# Altium project PCIe_Camera_Interface.PrjPcb
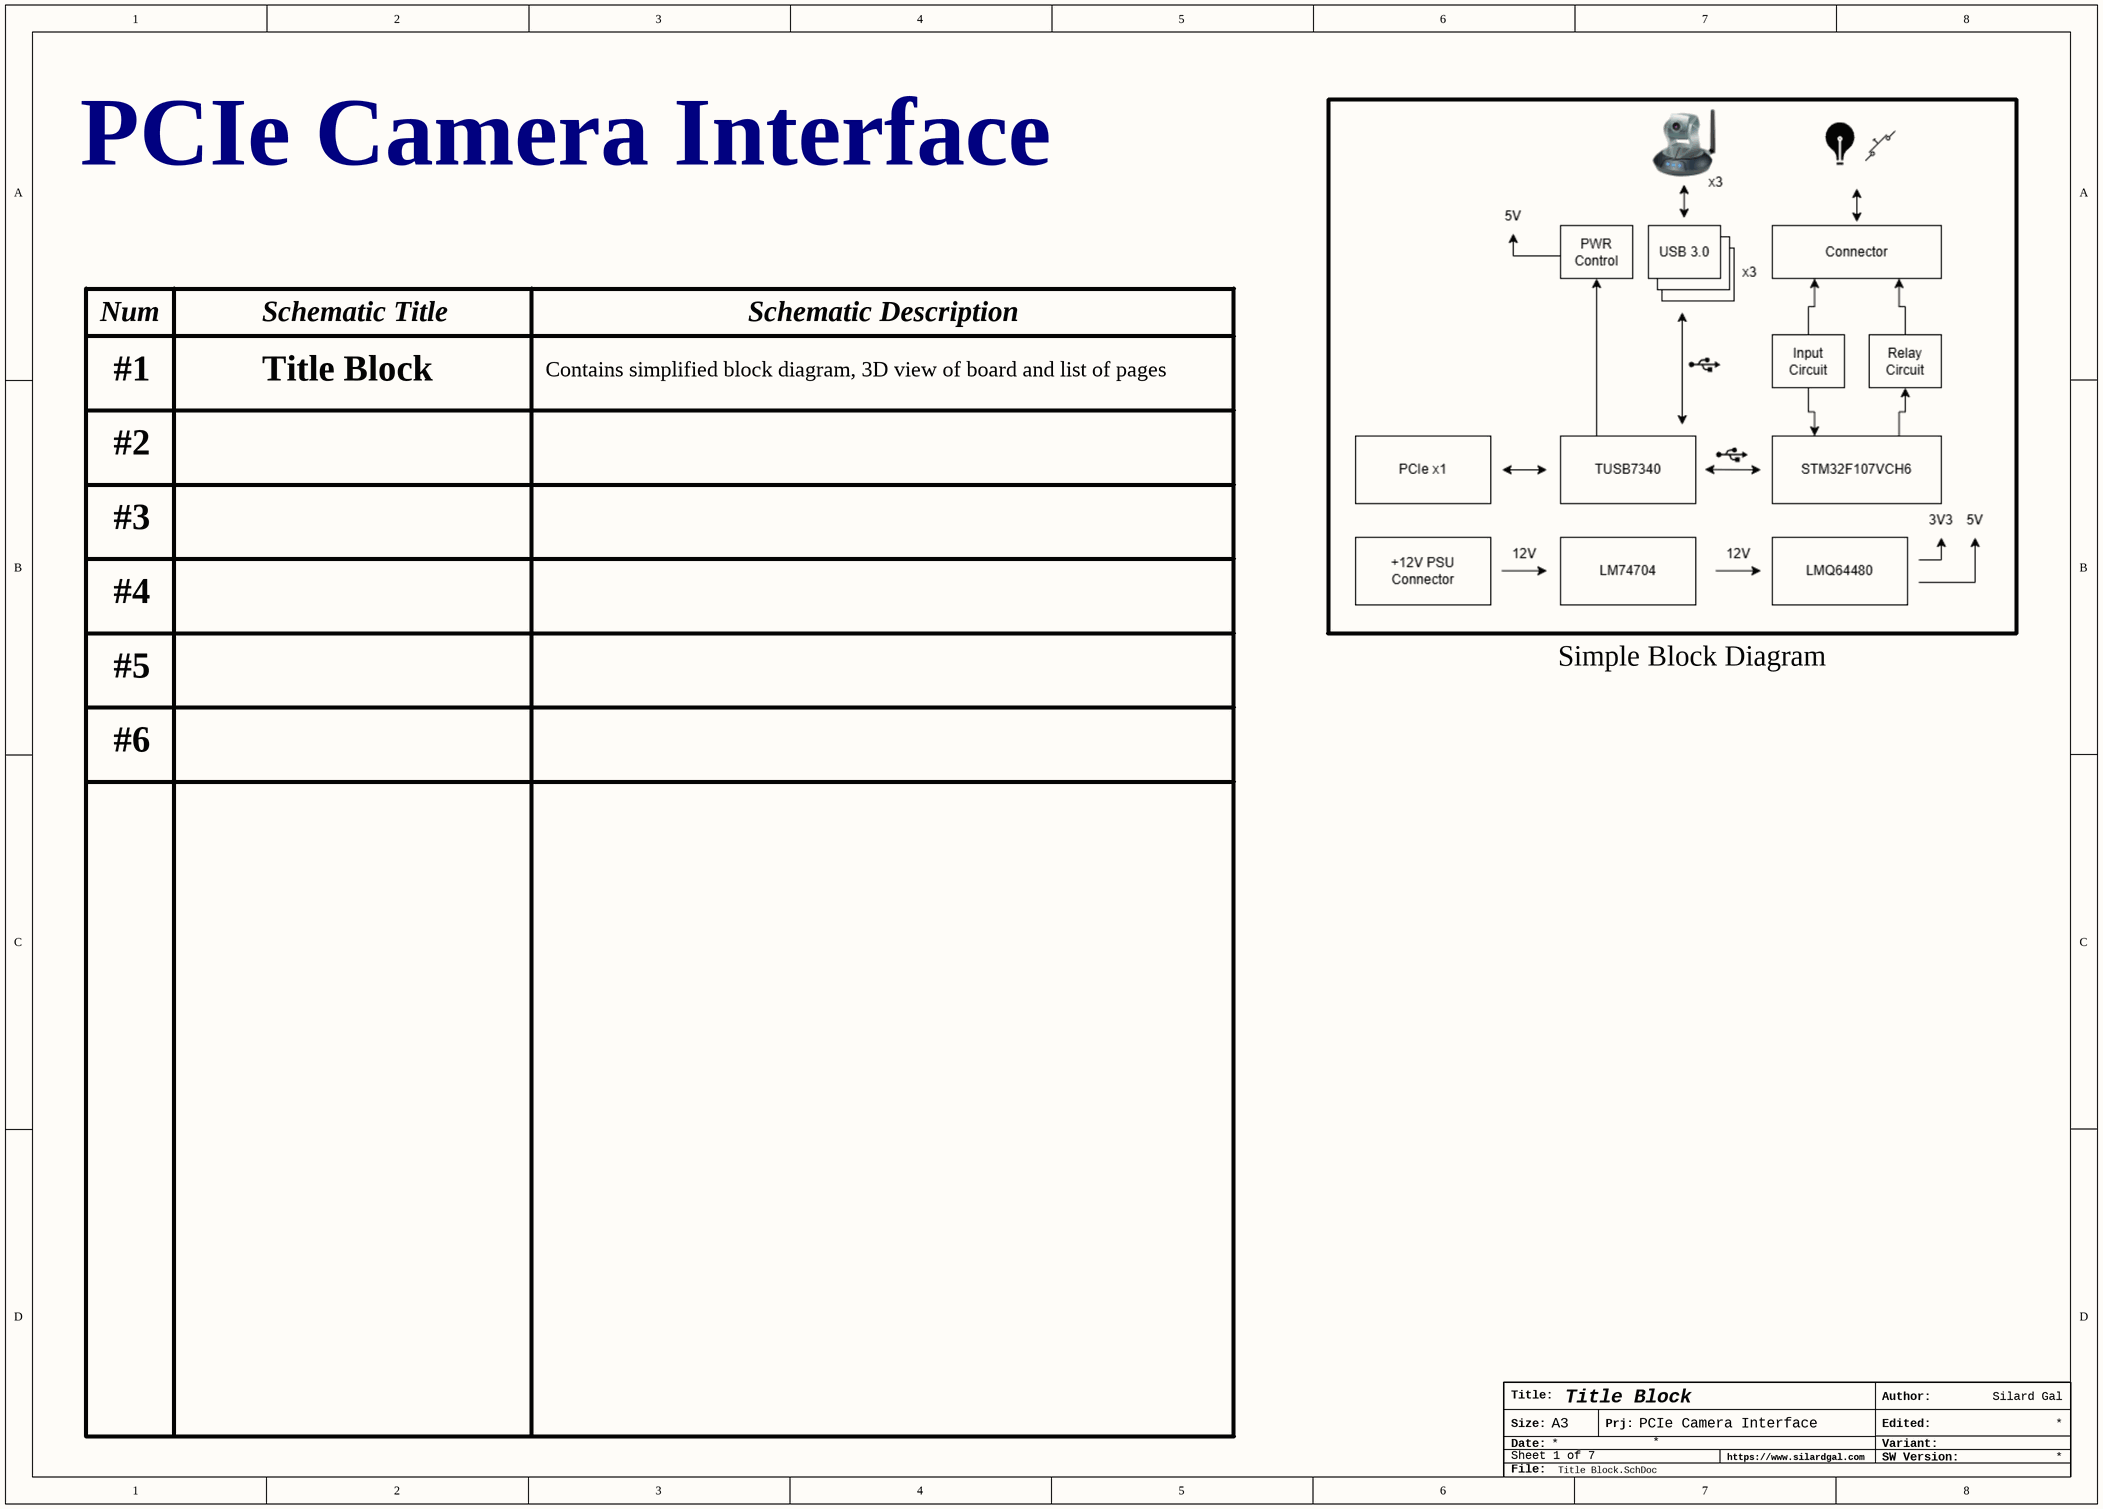
[diagram p0: Title Block.SchDoc]
ProjectTitle: PCIe Camera Interface
7 sheets, 241 parts. Net scope: hierarchical (ports join the sheet entries above them; power ports are global).
Board file: PCIe_Camera_Interface.PcbDoc
Sheets:
  Title Block.SchDoc
  Top Overview.SchDoc
    Connector = Connectors.SchDoc
    Peripherals = Peripherals.SchDoc
    PCIe to USB = PCIe_USB.SchDoc
    Microcontroller = MCU.SchDoc
    Power = Power.SchDoc

## Sheet Title Block.SchDoc: Title Block
size A3; Author: Silard Gal; SheetNumber: 1; SheetTotal: 7

### Notes on the sheet
- PCIe Camera Interface
- Num
- Schematic Title
- Contains simplified block diagram, 3D view of board and list of pages
- Schematic Description
- #1
- Title Block
- #2
- #3
- #4
- #5
- Simple Block Diagram
- #6
- Title:
- Author:
- Size:
- Date:
- A3
- Prj:
- https://www.silardgal.com
- SW Version:
- Variant:
- Edited:
- File:

## Sheet Top Overview.SchDoc: Top Overview
size A3; Author: Silard Gal; SheetNumber: 2; SheetTotal: 7
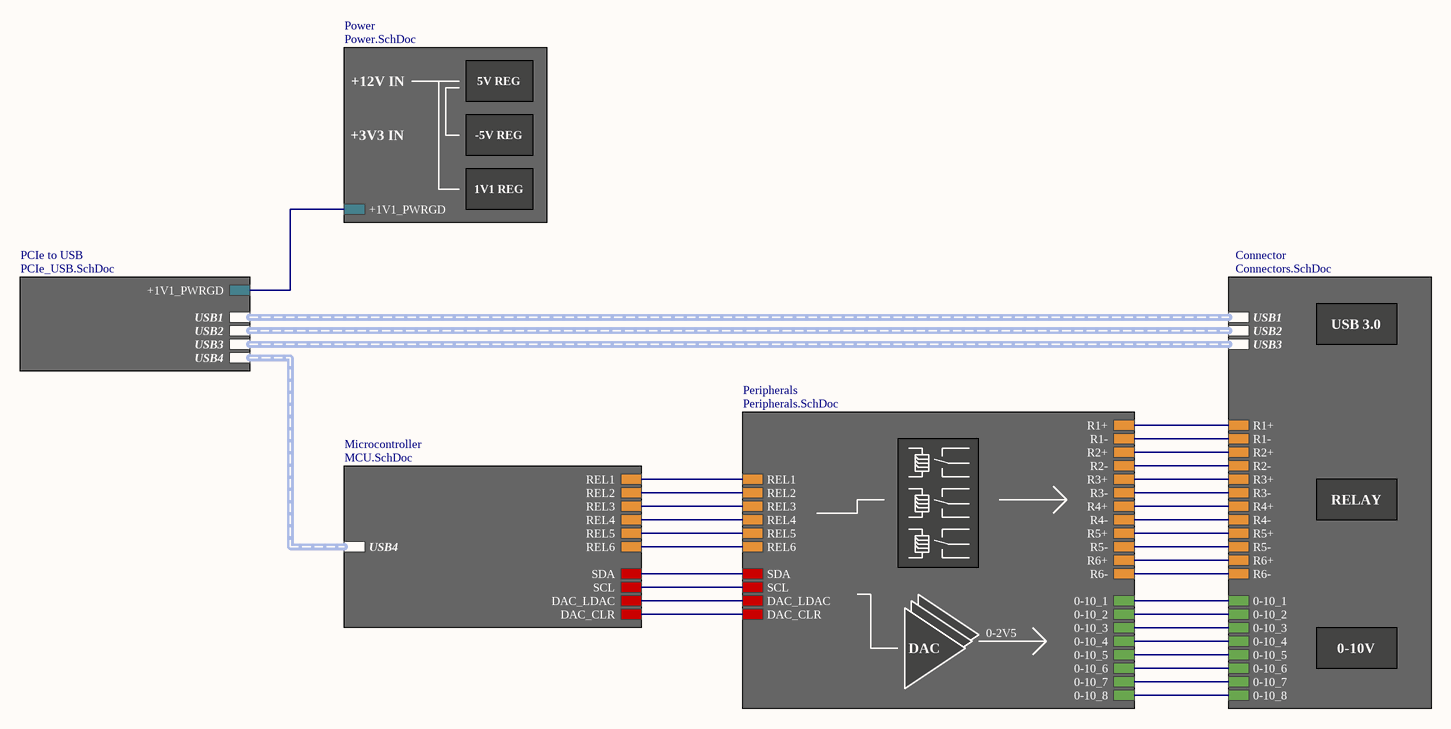
[diagram p1: Top Overview.SchDoc]

### Sub-sheets
Connector = Connectors.SchDoc: 0-10_2, 0-10_8, R4+, R2+, R4-, R1-, R3-, USB1 (harness USB_1), 0-10_6, USB3 (harness USB_3), 0-10_4, R6+, R2-, 0-10_7, R5+, R3+, R1+, 0-10_5, USB2 (harness USB_2), R5-, R6-, 0-10_3, 0-10_1
Microcontroller = MCU.SchDoc: SCL, REL5, REL4, DAC_LDAC, REL2, DAC_CLR, REL6, REL3, REL1, SDA, USB4 (harness USB_4)
PCIe to USB = PCIe_USB.SchDoc: USB4 (harness USB_4), USB2 (harness USB_2), USB3 (harness USB_3), USB1 (harness USB_1), +1V1_PWRGD
Peripherals = Peripherals.SchDoc: REL4, REL2, DAC_CLR, REL1, 0-10_6, REL6, REL3, R2+, 0-10_3, 0-10_2, 0-10_8, 0-10_4, R1+, 0-10_5, DAC_LDAC, SDA, R2-, SCL, 0-10_7, REL5, R1-, 0-10_1, R3-, R3+, R6+, R5-, R4+, R6-, R5+, R4-
Power = Power.SchDoc: +1V1_PWRGD

### Nets
NetC70_2: sheet Connector/0-10_1, sheet Peripherals/0-10_1
NetC73_2: sheet Connector/0-10_2, sheet Peripherals/0-10_2
NetC74_2: sheet Connector/0-10_3, sheet Peripherals/0-10_3
NetC78_2: sheet Connector/0-10_4, sheet Peripherals/0-10_4
NetC79_2: sheet Connector/0-10_5, sheet Peripherals/0-10_5
NetC82_2: sheet Connector/0-10_6, sheet Peripherals/0-10_6
NetC83_2: sheet Connector/0-10_7, sheet Peripherals/0-10_7
NetC86_2: sheet Connector/0-10_8, sheet Peripherals/0-10_8
NetJ7_1: sheet Connector/R1+, sheet Peripherals/R1+
NetJ7_2: sheet Connector/R2+, sheet Peripherals/R2+
NetJ7_3: sheet Connector/R3+, sheet Peripherals/R3+
NetJ7_4: sheet Connector/R4+, sheet Peripherals/R4+
NetJ7_5: sheet Connector/R5+, sheet Peripherals/R5+
NetJ7_6: sheet Connector/R6+, sheet Peripherals/R6+
NetJ7_13: sheet Connector/R1-, sheet Peripherals/R1-
NetJ7_14: sheet Connector/R2-, sheet Peripherals/R2-
NetJ7_15: sheet Connector/R3-, sheet Peripherals/R3-
NetJ7_16: sheet Connector/R4-, sheet Peripherals/R4-
NetJ7_17: sheet Connector/R5-, sheet Peripherals/R5-
NetJ7_18: sheet Connector/R6-, sheet Peripherals/R6-
NetR5_1: sheet PCIe to USB/+1V1_PWRGD, sheet Power/+1V1_PWRGD
NetR31_2: sheet Peripherals/DAC_LDAC, sheet Microcontroller/DAC_LDAC
NetR32_2: sheet Peripherals/DAC_CLR, sheet Microcontroller/DAC_CLR
NetR33_2: sheet Peripherals/SDA, sheet Microcontroller/SDA
NetR34_2: sheet Peripherals/SCL, sheet Microcontroller/SCL
NetR35_1: sheet Peripherals/REL1, sheet Microcontroller/REL1
NetR36_1: sheet Peripherals/REL2, sheet Microcontroller/REL2
NetR37_1: sheet Peripherals/REL3, sheet Microcontroller/REL3
NetR38_1: sheet Peripherals/REL4, sheet Microcontroller/REL4
NetR47_1: sheet Peripherals/REL5, sheet Microcontroller/REL5
NetR48_1: sheet Peripherals/REL6, sheet Microcontroller/REL6

### Buses and harness runs
harness sheet Connector/USB1 = sheet PCIe to USB/USB1
harness sheet Connector/USB2 = sheet PCIe to USB/USB2
harness sheet Connector/USB3 = sheet PCIe to USB/USB3
harness sheet Microcontroller/USB4 = sheet PCIe to USB/USB4

### Notes on the sheet
- +12V IN
- +3V3 IN
- -5V REG
- 5V REG
- 1V1 REG
- USB 3.0
- RELAY
- DAC
- 0-2V5
- 0-10V
- Title:
- Author:
- Size:
- Date:
- A3
- Prj:
- https://www.silardgal.com
- SW Version:
- Variant:
- Edited:
- File:

## Sheet Connectors.SchDoc: Connectors
size A3; Author: Silard Gal; SheetNumber: 7; SheetTotal: 7
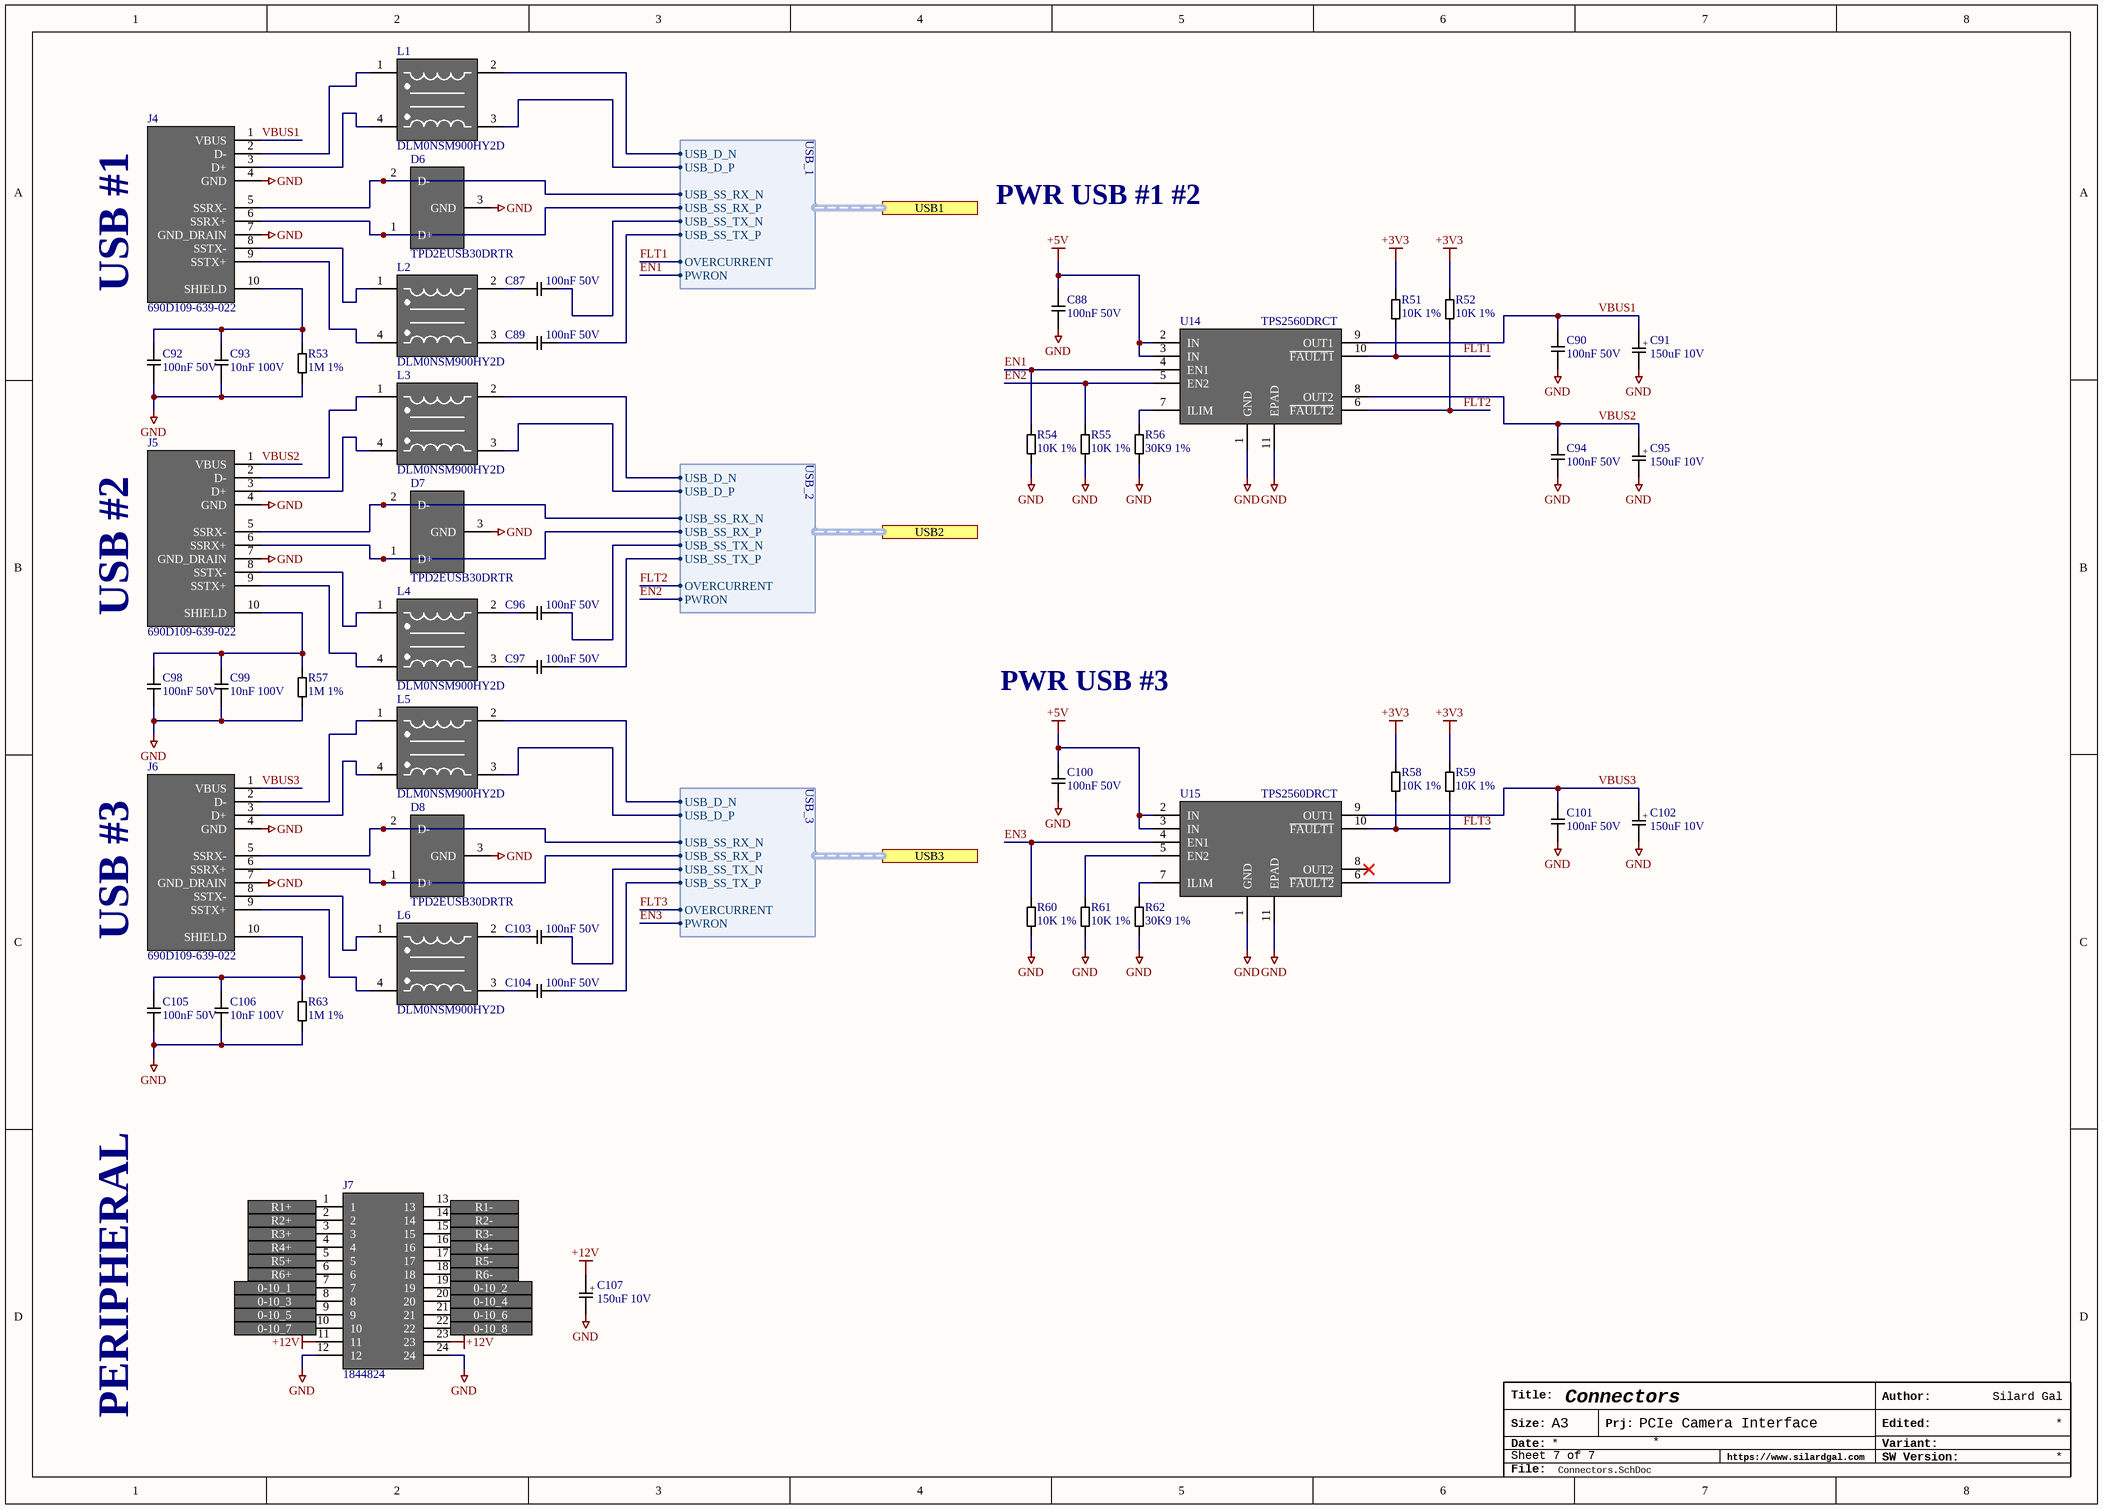
[diagram p2: Connectors.SchDoc]

### Parts
C87  100nF 50V  [CAPC1005X06N]
C88  100nF 50V  [CAPC1608X06N]
C89  100nF 50V  [CAPC1005X06N]
C90  100nF 50V  [CAPC1608X06N]
C91  150uF 10V  [CAP66x66x58]
C92  100nF 50V  [CAPC1608X06N]
C93  10nF 100V  [CAPC1608X06N]
C94  100nF 50V  [CAPC1608X06N]
C95  150uF 10V  [CAP66x66x58]
C96  100nF 50V  [CAPC1005X06N]
C97  100nF 50V  [CAPC1005X06N]
C98  100nF 50V  [CAPC1608X06N]
C99  10nF 100V  [CAPC1608X06N]
C100  100nF 50V  [CAPC1608X06N]
C101  100nF 50V  [CAPC1608X06N]
C102  150uF 10V  [CAP66x66x58]
C103  100nF 50V  [CAPC1005X06N]
C104  100nF 50V  [CAPC1005X06N]
C105  100nF 50V  [CAPC1608X06N]
C106  10nF 100V  [CAPC1608X06N]
C107  150uF 10V  [CAP66x66x58]
D6  TPD2EUSB30DRTR  [SOTFL35P100X50-3N]
D7  TPD2EUSB30DRTR  [SOTFL35P100X50-3N]
D8  TPD2EUSB30DRTR  [SOTFL35P100X50-3N]
J4  690D109-639-022  [690D109-639-022]
J5  690D109-639-022  [690D109-639-022]
J6  690D109-639-022  [690D109-639-022]
J7  1844824  [PHOENIX_1844824]
L1  DLM0NSM900HY2D  [DLM0NSM900HY2D]
L2  DLM0NSM900HY2D  [DLM0NSM900HY2D]
L3  DLM0NSM900HY2D  [DLM0NSM900HY2D]
L4  DLM0NSM900HY2D  [DLM0NSM900HY2D]
L5  DLM0NSM900HY2D  [DLM0NSM900HY2D]
L6  DLM0NSM900HY2D  [DLM0NSM900HY2D]
R51  10K 1%  [RESC1608X06N]
R52  10K 1%  [RESC1608X06N]
R53  1M 1%  [RESC1608X06N]
R54  10K 1%  [RESC1608X06N]
R55  10K 1%  [RESC1608X06N]
R56  30K9 1%  [RESC1608X06N]
R57  1M 1%  [RESC1608X06N]
R58  10K 1%  [RESC1608X06N]
R59  10K 1%  [RESC1608X06N]
R60  10K 1%  [RESC1608X06N]
R61  10K 1%  [RESC1608X06N]
R62  30K9 1%  [RESC1608X06N]
R63  1M 1%  [RESC1608X06N]
U14  TPS2560DRCT  [10VSON]
U15  TPS2560DRCT  [10VSON]

### Ports
0-10_1, 0-10_2, 0-10_3, 0-10_4, 0-10_5, 0-10_6, 0-10_7, 0-10_8, R1+, R1-, R2+, R2-, R3+, R3-, R4+, R4-, R5+, R5-, R6+, R6-, USB1 (harness USB_1), USB2 (harness USB_2), USB3 (harness USB_3)

### Harnesses
USB_3: USB_D_P, USB_D_N, USB_SS_TX_P, USB_SS_TX_N, USB_SS_RX_P, USB_SS_RX_N, OVERCURRENT, PWRON
USB_2: USB_D_P, USB_D_N, USB_SS_TX_P, USB_SS_TX_N, USB_SS_RX_P, USB_SS_RX_N, OVERCURRENT, PWRON
USB_1: USB_D_P, USB_D_N, USB_SS_TX_P, USB_SS_TX_N, USB_SS_RX_P, USB_SS_RX_N, OVERCURRENT, PWRON

### Nets
+3V3: R51.2 R52.2 R58.2 R59.2
+5V: C88.2 C100.2 U14.2(IN) U14.3(IN) U15.2(IN) U15.3(IN)
+12V: C107.1 J7.11 J7.23
GND: C88.1 C90.1 C91.2 C92.1 C93.1 C94.1 C95.2 C98.1 C99.1 C100.1 C101.1 C102.2 C105.1 C106.1 C107.2 D6.3(GND) D7.3(GND) D8.3(GND) J4.4(GND) J4.7(GND_DRAIN) J5.4(GND) J5.7(GND_DRAIN) J6.4(GND) J6.7(GND_DRAIN) J7.12 J7.24 R53.1 R54.1 R55.1 R56.1 R57.1 R60.1 R61.1 R62.1 R63.1 U14.1(GND) U14.11(EPAD) U15.1(GND) U15.11(EPAD)
EN1: R54.2 U14.4(EN1) ; port USB1.PWRON
EN2: R55.2 U14.5(EN2) ; port USB2.PWRON
EN3: R60.2 U15.4(EN1) ; port USB3.PWRON
FLT1: R51.1 U14.10(~{FAULT1}) ; port USB1.OVERCURRENT
FLT2: R52.1 U14.6(~{FAULT2}) ; port USB2.OVERCURRENT
FLT3: R58.1 U15.10(~{FAULT1}) ; port USB3.OVERCURRENT
VBUS1: C90.2 C91.1 J4.1(VBUS) U14.9(OUT1)
VBUS2: C94.2 C95.1 J5.1(VBUS) U14.8(OUT2)
VBUS3: C101.2 C102.1 J6.1(VBUS) U15.9(OUT1)
NetC70_2: J7.7 ; port 0-10_1
NetC73_2: J7.19 ; port 0-10_2
NetC74_2: J7.8 ; port 0-10_3
NetC78_2: J7.20 ; port 0-10_4
NetC79_2: J7.9 ; port 0-10_5
NetC82_2: J7.21 ; port 0-10_6
NetC83_2: J7.10 ; port 0-10_7
NetC86_2: J7.22 ; port 0-10_8
NetC87_1: C87.1 L2.2
NetC87_2: C87.2 ; port USB1.USB_SS_TX_N
NetC89_1: C89.1 L2.3
NetC89_2: C89.2 ; port USB1.USB_SS_TX_P
NetC92_2: C92.2 C93.2 J4.10(SHIELD) R53.2
NetC96_1: C96.1 L4.2
NetC96_2: C96.2 ; port USB2.USB_SS_TX_N
NetC97_1: C97.1 L4.3
NetC97_2: C97.2 ; port USB2.USB_SS_TX_P
NetC98_2: C98.2 C99.2 J5.10(SHIELD) R57.2
NetC103_1: C103.1 L6.2
NetC103_2: C103.2 ; port USB3.USB_SS_TX_N
NetC104_1: C104.1 L6.3
NetC104_2: C104.2 ; port USB3.USB_SS_TX_P
NetC105_2: C105.2 C106.2 J6.10(SHIELD) R63.2
NetD6_1: D6.1(D+) J4.6(SSRX+) ; port USB1.USB_SS_RX_P
NetD6_2: D6.2(D-) J4.5(SSRX-) ; port USB1.USB_SS_RX_N
NetD7_1: D7.1(D+) J5.6(SSRX+) ; port USB2.USB_SS_RX_P
NetD7_2: D7.2(D-) J5.5(SSRX-) ; port USB2.USB_SS_RX_N
NetD8_1: D8.1(D+) J6.6(SSRX+) ; port USB3.USB_SS_RX_P
NetD8_2: D8.2(D-) J6.5(SSRX-) ; port USB3.USB_SS_RX_N
NetJ4_2: J4.2(D-) L1.1
NetJ4_3: J4.3(D+) L1.4
NetJ4_8: J4.8(SSTX-) L2.1
NetJ4_9: J4.9(SSTX+) L2.4
NetJ5_2: J5.2(D-) L3.1
NetJ5_3: J5.3(D+) L3.4
NetJ5_8: J5.8(SSTX-) L4.1
NetJ5_9: J5.9(SSTX+) L4.4
NetJ6_2: J6.2(D-) L5.1
NetJ6_3: J6.3(D+) L5.4
NetJ6_8: J6.8(SSTX-) L6.1
NetJ6_9: J6.9(SSTX+) L6.4
NetJ7_1: J7.1 ; port R1+
NetJ7_2: J7.2 ; port R2+
NetJ7_3: J7.3 ; port R3+
NetJ7_4: J7.4 ; port R4+
NetJ7_5: J7.5 ; port R5+
NetJ7_6: J7.6 ; port R6+
NetJ7_13: J7.13 ; port R1-
NetJ7_14: J7.14 ; port R2-
NetJ7_15: J7.15 ; port R3-
NetJ7_16: J7.16 ; port R4-
NetJ7_17: J7.17 ; port R5-
NetJ7_18: J7.18 ; port R6-
NetL1_2: L1.2 ; port USB1.USB_D_N
NetL1_3: L1.3 ; port USB1.USB_D_P
NetL3_2: L3.2 ; port USB2.USB_D_N
NetL3_3: L3.3 ; port USB2.USB_D_P
NetL5_2: L5.2 ; port USB3.USB_D_N
NetL5_3: L5.3 ; port USB3.USB_D_P
NetR56_2: R56.2 U14.7(ILIM)
NetR59_1: R59.1 U15.6(~{FAULT2})
NetR61_2: R61.2 U15.5(EN2)
NetR62_2: R62.2 U15.7(ILIM)

Not connected (* = marked no-connect by the designer): U15 8(OUT2)*

### Notes on the sheet
- USB #1
- PWR USB #1 #2
- USB #2
- PWR USB #3
- USB #3
- PERIPHERAL
- Title:
- Author:
- Size:
- Date:
- A3
- Prj:
- https://www.silardgal.com
- SW Version:
- Variant:
- Edited:
- File:
- (in symbol 150uF 10V) +

### Library data of the parts
C87 C89 C96 C97 C103 C104 = 100nF 50V_1: 0.1 µF ±10% 16V Ceramic Capacitor X7R 0402 (1005 Metric); MPN: GRM155R71C104KA88J
C88 C90 C92 C94 C98 C100 C101 C105 = 100nF 50V: 0.1 µF ±10% 50V Ceramic Capacitor X7R 0603 (1608 Metric); MPN: GCM188R71H104KA57D
C91 C95 C102 C107 = 150uF 10V: 150 µF 10 V Aluminum - Polymer Capacitors Radial, Can - SMD 30mOhm 2000 Hrs @ 105°C; MPN: 875105244011
C93 C99 C106 = 10nF 100V: 10000 pF ±10% 100V Ceramic Capacitor X7R 0603 (1608 Metric); MPN: GCM188R72A103KA37D
D6-D8 = TPD2EUSB30DRTR: 8V Clamp 5A (8/20µs) Ipp Tvs Diode Surface Mount SOT-3; MPN: TPD2EUSB30DRTR
J4-J6 = 690D109-639-022: USB-A (USB TYPE-A) USB 3.0 Receptacle Connector 9 Position Through Hole, Right Angle; MPN: 690D109-639-022
J7 = 1844824: 24 Position Terminal Block Header, Male Pins, Shrouded (4 Side) 0.100" (2.54mm) 90°, Right Angle Through Hole; MPN: 1844824
L1-L6 = DLM0NSM900HY2D: 2 Line Common Mode Choke Surface Mount 90 Ohms @ 100 MHz 100mA DCR 4Ohm; MPN: DLM0NSM900HY2D
R51 R52 R54 R55 R58-R61 = 10K 1%: 10 kOhms ±1% 0.1W, 1/10W Chip Resistor 0603 (1608 Metric) Automotive AEC-Q200 Thick Film; MPN: ERJ-3EKF1002V
R53 R57 R63 = 1M 1%: RES SMD 1M OHM 1% 1/10W 0603; MPN: ERJ-3EKF1004V
R56 R62 = 30K9 1%: 30.9 kOhms ±1% 0.1W, 1/10W Chip Resistor 0603 (1608 Metric) Automotive AEC-Q200 Thick Film; MPN: ERJ-3EKF3092V
U14 U15 = TPS2560DRCT: Power Switch/Driver 1:2 N-Channel 2.5A 10-VSON (3x3); MPN: TPS2560DRCT

## Sheet Peripherals.SchDoc: Peripherals
size A3; Author: Silard Gal; SheetNumber: 6; SheetTotal: 7
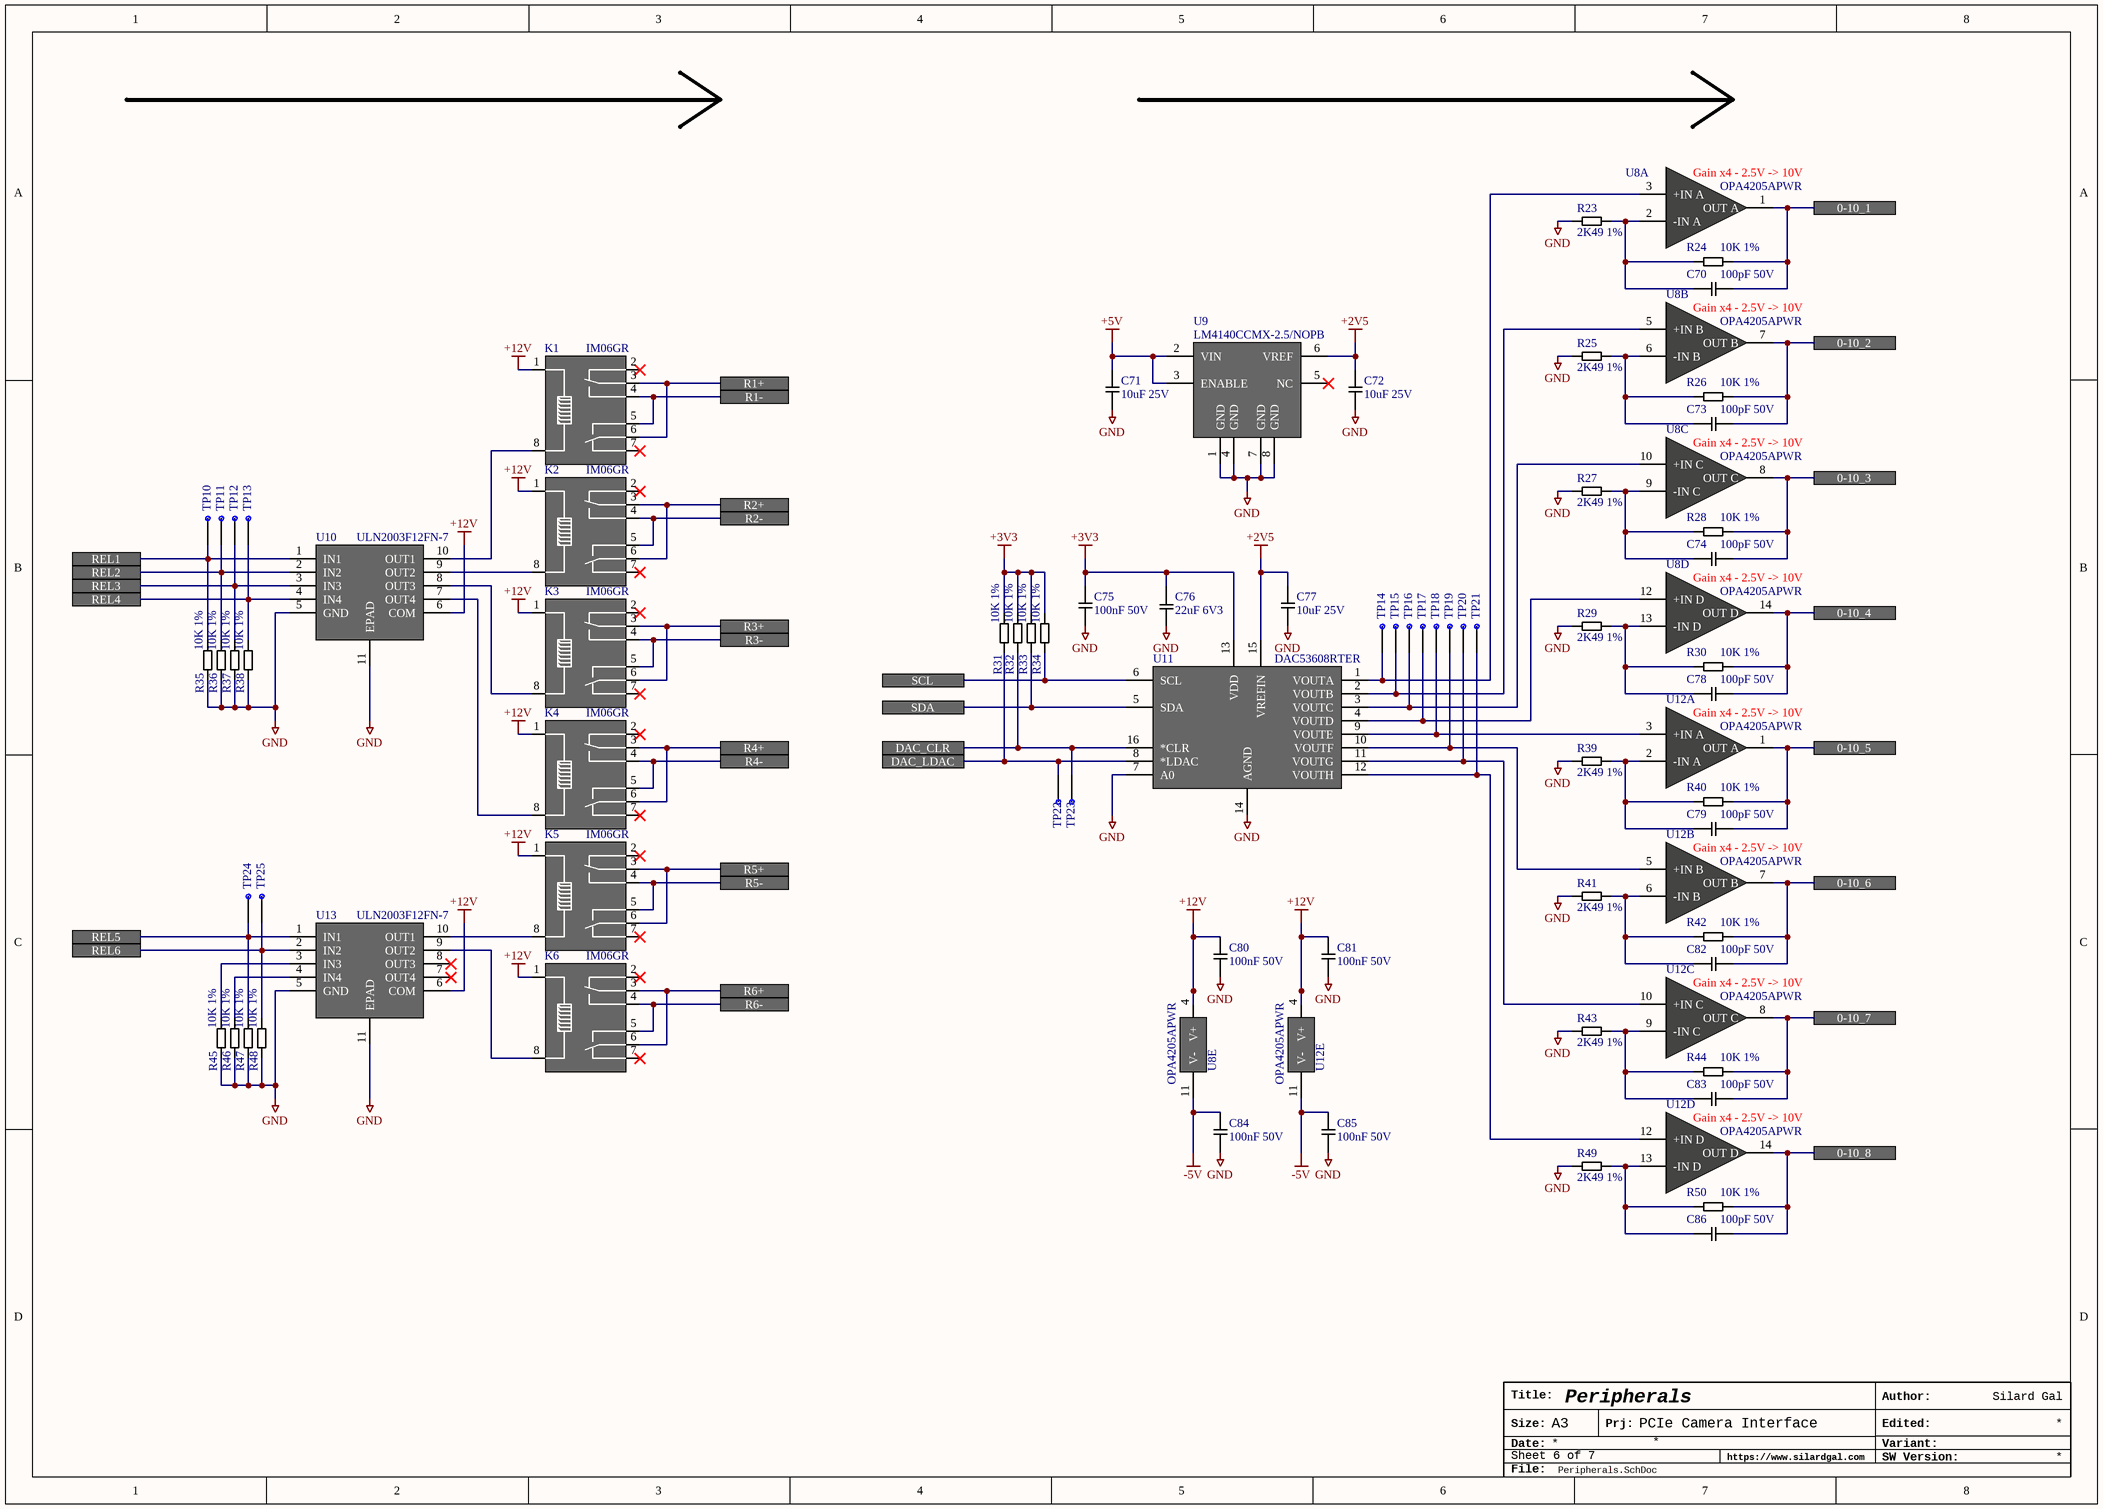
[diagram p3: Peripherals.SchDoc]

### Parts
C70  100pF 50V  [CAPC1608X06N]
C71  10uF 25V  [CAPC1608X06N]
C72  10uF 25V  [CAPC1608X06N]
C73  100pF 50V  [CAPC1608X06N]
C74  100pF 50V  [CAPC1608X06N]
C75  100nF 50V  [CAPC1608X06N]
C76  22uF 6V3  [CAPC1608X06N]
C77  10uF 25V  [CAPC1608X06N]
C78  100pF 50V  [CAPC1608X06N]
C79  100pF 50V  [CAPC1608X06N]
C80  100nF 50V  [CAPC1608X06N]
C81  100nF 50V  [CAPC1608X06N]
C82  100pF 50V  [CAPC1608X06N]
C83  100pF 50V  [CAPC1608X06N]
C84  100nF 50V  [CAPC1608X06N]
C85  100nF 50V  [CAPC1608X06N]
C86  100pF 50V  [CAPC1608X06N]
K1  IM06GR  [IM06GR]
K2  IM06GR  [IM06GR]
K3  IM06GR  [IM06GR]
K4  IM06GR  [IM06GR]
K5  IM06GR  [IM06GR]
K6  IM06GR  [IM06GR]
R23  2K49 1%  [RESC1608X06N]
R24  10K 1%  [RESC1608X06N]
R25  2K49 1%  [RESC1608X06N]
R26  10K 1%  [RESC1608X06N]
R27  2K49 1%  [RESC1608X06N]
R28  10K 1%  [RESC1608X06N]
R29  2K49 1%  [RESC1608X06N]
R30  10K 1%  [RESC1608X06N]
R31  10K 1%  [RESC1608X06N]
R32  10K 1%  [RESC1608X06N]
R33  10K 1%  [RESC1608X06N]
R34  10K 1%  [RESC1608X06N]
R35  10K 1%  [RESC1608X06N]
R36  10K 1%  [RESC1608X06N]
R37  10K 1%  [RESC1608X06N]
R38  10K 1%  [RESC1608X06N]
R39  2K49 1%  [RESC1608X06N]
R40  10K 1%  [RESC1608X06N]
R41  2K49 1%  [RESC1608X06N]
R42  10K 1%  [RESC1608X06N]
R43  2K49 1%  [RESC1608X06N]
R44  10K 1%  [RESC1608X06N]
R45  10K 1%  [RESC1608X06N]
R46  10K 1%  [RESC1608X06N]
R47  10K 1%  [RESC1608X06N]
R48  10K 1%  [RESC1608X06N]
R49  2K49 1%  [RESC1608X06N]
R50  10K 1%  [RESC1608X06N]
TP10  TP  [TP]  (value not drawn)  (no BOM)
TP11  TP  [TP]  (value not drawn)  (no BOM)
TP12  TP  [TP]  (value not drawn)  (no BOM)
TP13  TP  [TP]  (value not drawn)  (no BOM)
TP14  TP  [TP]  (value not drawn)  (no BOM)
TP15  TP  [TP]  (value not drawn)  (no BOM)
TP16  TP  [TP]  (value not drawn)  (no BOM)
TP17  TP  [TP]  (value not drawn)  (no BOM)
TP18  TP  [TP]  (value not drawn)  (no BOM)
TP19  TP  [TP]  (value not drawn)  (no BOM)
TP20  TP  [TP]  (value not drawn)  (no BOM)
TP21  TP  [TP]  (value not drawn)  (no BOM)
TP22  TP  [TP]  (value not drawn)  (no BOM)
TP23  TP  [TP]  (value not drawn)  (no BOM)
TP24  TP  [TP]  (value not drawn)  (no BOM)
TP25  TP  [TP]  (value not drawn)  (no BOM)
U8  OPA4205APWR  [TSSO14P440]  (parts A,B,C,D,E of 5)
U9  LM4140CCMX-2.5/NOPB  [SOIC127P599X175-8N]
U10  ULN2003F12FN-7  [DFN3030]
U11  DAC53608RTER  [QFN16P300X300]
U12  OPA4205APWR  [TSSO14P440]  (parts A,B,C,D,E of 5)
U13  ULN2003F12FN-7  [DFN3030]

### Ports
0-10_1, 0-10_2, 0-10_3, 0-10_4, 0-10_5, 0-10_6, 0-10_7, 0-10_8, DAC_CLR, DAC_LDAC, R1+, R1-, R2+, R2-, R3+, R3-, R4+, R4-, R5+, R5-, R6+, R6-, REL1, REL2, REL3, REL4, REL5, REL6, SCL, SDA

### Nets
+2V5: C72.2 C77.2 U9.6(VREF) U11.15(VREFIN)
+3V3: C75.2 C76.1 R31.1 R32.1 R33.1 R34.1 U11.13(VDD)
+5V: C71.2 U9.2(VIN) U9.3(ENABLE)
+12V: C80.2 C81.2 K1.1 K2.1 K3.1 K4.1 K5.1 K6.1 U8.4(V+) U10.6(COM) U12.4(V+) U13.6(COM)
-5V: C84.2 C85.2 U8.11(V-) U12.11(V-)
GND: C71.1 C72.1 C75.1 C76.2 C77.1 C80.1 C81.1 C84.1 C85.1 R23.1 R25.1 R27.1 R29.1 R35.2 R36.2 R37.2 R38.2 R39.1 R41.1 R43.1 R45.2 R46.2 R47.2 R48.2 R49.1 U9.1(GND) U9.4(GND) U9.7(GND) U9.8(GND) U10.5(GND) U10.11(EPAD) U11.7(A0) U11.14(AGND) U13.5(GND) U13.11(EPAD)
NetC70_1: C70.1 R23.2 R24.1 U8.2(-IN_A)
NetC70_2: C70.2 R24.2 U8.1(OUT_A) ; port 0-10_1
NetC73_1: C73.1 R25.2 R26.1 U8.6(-IN_B)
NetC73_2: C73.2 R26.2 U8.7(OUT_B) ; port 0-10_2
NetC74_1: C74.1 R27.2 R28.1 U8.9(-IN_C)
NetC74_2: C74.2 R28.2 U8.8(OUT_C) ; port 0-10_3
NetC78_1: C78.1 R29.2 R30.1 U8.13(-IN_D)
NetC78_2: C78.2 R30.2 U8.14(OUT_D) ; port 0-10_4
NetC79_1: C79.1 R39.2 R40.1 U12.2(-IN_A)
NetC79_2: C79.2 R40.2 U12.1(OUT_A) ; port 0-10_5
NetC82_1: C82.1 R41.2 R42.1 U12.6(-IN_B)
NetC82_2: C82.2 R42.2 U12.7(OUT_B) ; port 0-10_6
NetC83_1: C83.1 R43.2 R44.1 U12.9(-IN_C)
NetC83_2: C83.2 R44.2 U12.8(OUT_C) ; port 0-10_7
NetC86_1: C86.1 R49.2 R50.1 U12.13(-IN_D)
NetC86_2: C86.2 R50.2 U12.14(OUT_D) ; port 0-10_8
NetJ7_1: K1.3 K1.6 ; port R1+
NetJ7_2: K2.3 K2.6 ; port R2+
NetJ7_3: K3.3 K3.6 ; port R3+
NetJ7_4: K4.3 K4.6 ; port R4+
NetJ7_5: K5.3 K5.6 ; port R5+
NetJ7_6: K6.3 K6.6 ; port R6+
NetJ7_13: K1.4 K1.5 ; port R1-
NetJ7_14: K2.4 K2.5 ; port R2-
NetJ7_15: K3.4 K3.5 ; port R3-
NetJ7_16: K4.4 K4.5 ; port R4-
NetJ7_17: K5.4 K5.5 ; port R5-
NetJ7_18: K6.4 K6.5 ; port R6-
NetK1_8: K1.8 U10.10(OUT1)
NetK2_8: K2.8 U10.9(OUT2)
NetK3_8: K3.8 U10.8(OUT3)
NetK4_8: K4.8 U10.7(OUT4)
NetK5_8: K5.8 U13.10(OUT1)
NetK6_8: K6.8 U13.9(OUT2)
NetR31_2: R31.2 TP22.1 U11.8(*LDAC) ; port DAC_LDAC
NetR32_2: R32.2 TP23.1 U11.16(*CLR) ; port DAC_CLR
NetR33_2: R33.2 U11.5(SDA) ; port SDA
NetR34_2: R34.2 U11.6(SCL) ; port SCL
NetR35_1: R35.1 TP10.1 U10.1(IN1) ; port REL1
NetR36_1: R36.1 TP11.1 U10.2(IN2) ; port REL2
NetR37_1: R37.1 TP12.1 U10.3(IN3) ; port REL3
NetR38_1: R38.1 TP13.1 U10.4(IN4) ; port REL4
NetR45_1: R45.1 U13.3(IN3)
NetR46_1: R46.1 U13.4(IN4)
NetR47_1: R47.1 TP24.1 U13.1(IN1) ; port REL5
NetR48_1: R48.1 TP25.1 U13.2(IN2) ; port REL6
NetTP14_1: TP14.1 U8.3(+IN_A) U11.1(VOUTA)
NetTP15_1: TP15.1 U8.5(+IN_B) U11.2(VOUTB)
NetTP16_1: TP16.1 U8.10(+IN_C) U11.3(VOUTC)
NetTP17_1: TP17.1 U8.12(+IN_D) U11.4(VOUTD)
NetTP18_1: TP18.1 U11.9(VOUTE) U12.3(+IN_A)
NetTP19_1: TP19.1 U11.10(VOUTF) U12.5(+IN_B)
NetTP20_1: TP20.1 U11.11(VOUTG) U12.10(+IN_C)
NetTP21_1: TP21.1 U11.12(VOUTH) U12.12(+IN_D)

Not connected (* = marked no-connect by the designer): K1 2* 7*; K2 2* 7*; K3 2* 7*; K4 2* 7*; K5 2* 7*; K6 2* 7*; U9 5(NC)*; U13 7(OUT4)* 8(OUT3)*

### Notes on the sheet
- (near U8) Gain x4 - 2.5V -> 10V
- Gain x4 - 2.5V -> 10V
- Title:
- Author:
- Size:
- Date:
- A3
- Prj:
- https://www.silardgal.com
- SW Version:
- Variant:
- Edited:
- File:

### Library data of the parts
C70 C73 C74 C78 C79 C82 C83 C86 = 100pF 50V: 100 pF ±10% 50V Ceramic Capacitor C0G, NP0 0603 (1608 Metric); MPN: KGM15ACG1H101KT
C71 C72 C77 = 10uF 25V: 10 µF ±20% 25V Ceramic Capacitor X5R 0603 (1608 Metric); MPN: GRM188R61E106MA73D
C75 C80 C81 C84 C85 = 100nF 50V: as C88 on sheet Connectors
C76 = 22uF 6V3: 22 µF ±20% 6.3V Ceramic Capacitor X5R 0603 (1608 Metric); MPN: GRM188R60J226MEA0D
K1-K6 = IM06GR: Telecom Relay DPDT (2 Form C) Surface Mount; MPN: IM06GR
R23 R25 R27 R29 R39 R41 R43 R49 = 2K49 1%: 2.49 kOhms ±1% 0.1W, 1/10W Chip Resistor 0603 (1608 Metric) Automotive AEC-Q200 Thick Film; MPN: RMCF0603FT2K49
R24 R26 R28 R30-R38 R40 R42 R44-R48 R50 = 10K 1%: as R51 on sheet Connectors
U8 U12 = OPA4205APWR: General Purpose Amplifier 4 Circuit Push-Pull, Rail-to-Rail 14-TSSOP; MPN: OPA4205APWR
U9 = LM4140CCMX-2.5/NOPB: Series Voltage Reference IC Fixed 2.5V V ±0.1% 8 mA 8-SOIC; MPN: LM4140CCMX-2.5/NOPB
U10 U13 = ULN2003F12FN-7: Power Switch/Driver 1:1 Darlington 700mA U-DFN3030-10; MPN: ULN2003F12FN-7
U11 = DAC53608RTER: 10 Bit Digital to Analog Converter 8 16-WQFN (3x3); MPN: DAC53608RTER

## Sheet PCIe_USB.SchDoc: PCIe_USB
size A3; Author: Silard Gal; SheetNumber: 4; SheetTotal: 7
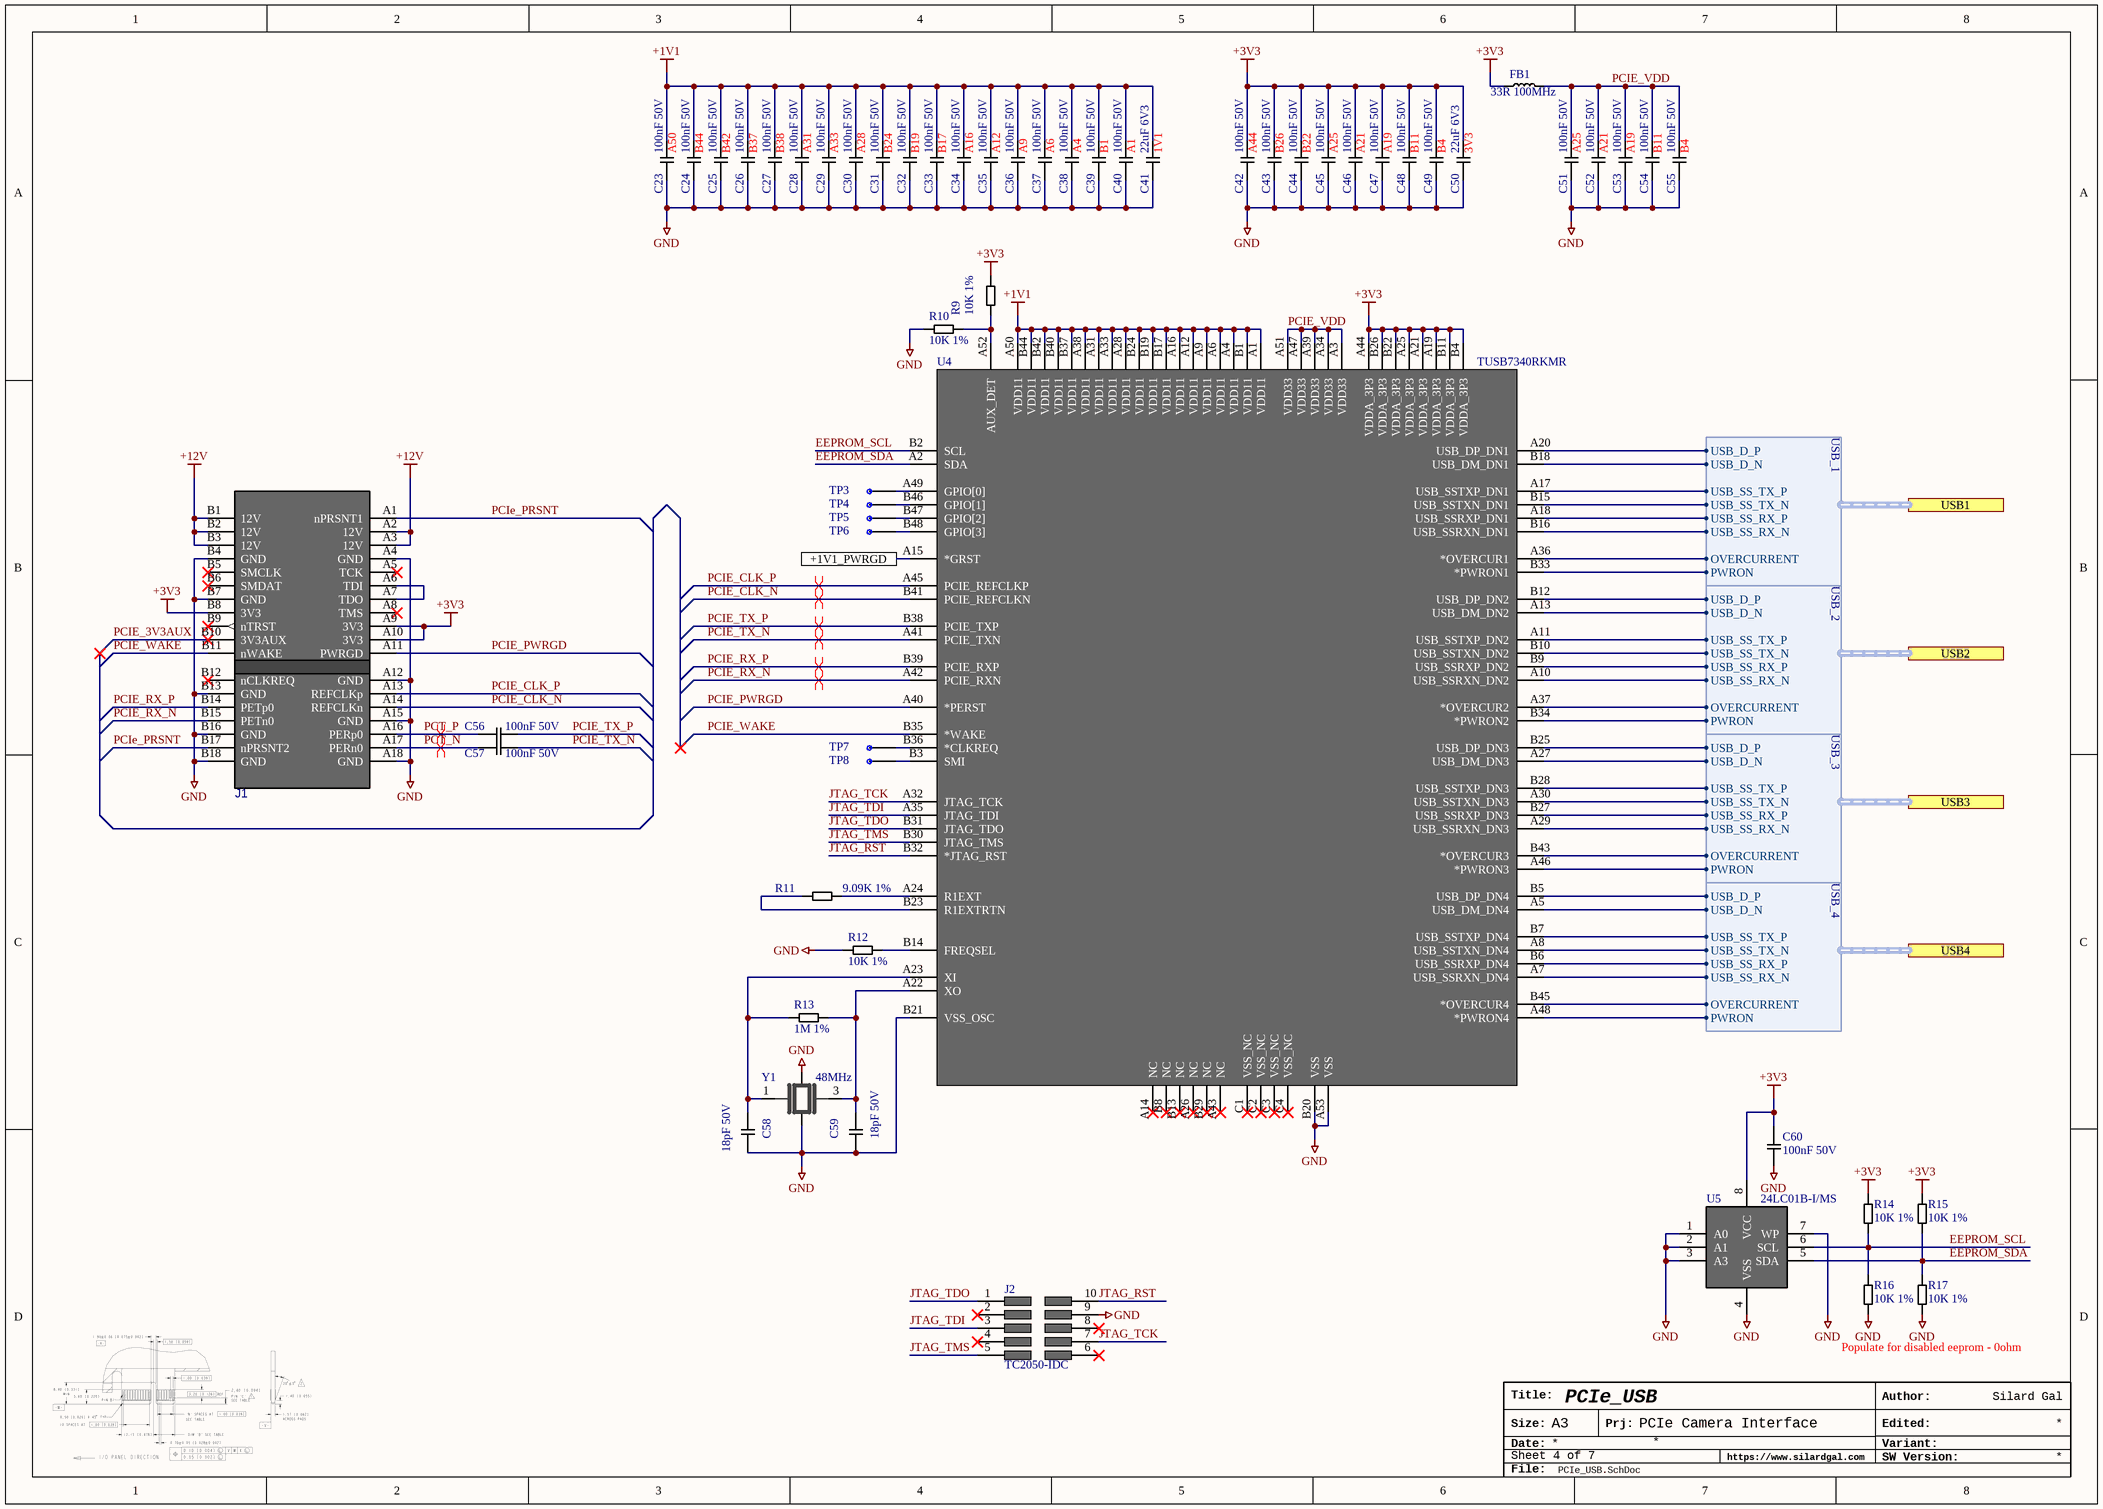
[diagram p4: PCIe_USB.SchDoc]

### Parts
C23  100nF 50V  [CAPC1608X06N]
C24  100nF 50V  [CAPC1608X06N]
C25  100nF 50V  [CAPC1608X06N]
C26  100nF 50V  [CAPC1608X06N]
C27  100nF 50V  [CAPC1608X06N]
C28  100nF 50V  [CAPC1608X06N]
C29  100nF 50V  [CAPC1608X06N]
C30  100nF 50V  [CAPC1608X06N]
C31  100nF 50V  [CAPC1608X06N]
C32  100nF 50V  [CAPC1608X06N]
C33  100nF 50V  [CAPC1608X06N]
C34  100nF 50V  [CAPC1608X06N]
C35  100nF 50V  [CAPC1608X06N]
C36  100nF 50V  [CAPC1608X06N]
C37  100nF 50V  [CAPC1608X06N]
C38  100nF 50V  [CAPC1608X06N]
C39  100nF 50V  [CAPC1608X06N]
C40  100nF 50V  [CAPC1608X06N]
C41  22uF 6V3  [CAPC1608X06N]
C42  100nF 50V  [CAPC1608X06N]
C43  100nF 50V  [CAPC1608X06N]
C44  100nF 50V  [CAPC1608X06N]
C45  100nF 50V  [CAPC1608X06N]
C46  100nF 50V  [CAPC1608X06N]
C47  100nF 50V  [CAPC1608X06N]
C48  100nF 50V  [CAPC1608X06N]
C49  100nF 50V  [CAPC1608X06N]
C50  22uF 6V3  [CAPC1608X06N]
C51  100nF 50V  [CAPC1608X06N]
C52  100nF 50V  [CAPC1608X06N]
C53  100nF 50V  [CAPC1608X06N]
C54  100nF 50V  [CAPC1608X06N]
C55  100nF 50V  [CAPC1608X06N]
C56  100nF 50V  [CAPC1005X06N]
C57  100nF 50V  [CAPC1005X06N]
C58  18pF 50V  [CAPC1608X06N]
C59  18pF 50V  [CAPC1608X06N]
C60  100nF 50V  [CAPC1608X06N]
FB1  33R 100MHz  [INDC1608X06N]
J1  PCIe x1  [CON FINGERS PCIEx1 1mm 36P PCB]  (value not drawn)  (no BOM)
J2  TC2050-IDC  [TAG_CONNECT]
R9  10K 1%  [RESC1608X06N]
R10  10K 1%  [RESC1608X06N]
R11  9.09K 1%  [RESC1608X06N]
R12  10K 1%  [RESC1608X06N]
R13  1M 1%  [RESC1608X06N]
R14  10K 1%  [RESC1608X06N]
R15  10K 1%  [RESC1608X06N]
R16  10K 1%  [RESC1608X06N]
R17  10K 1%  [RESC1608X06N]
TP3  TP  [TP]  (value not drawn)  (no BOM)
TP4  TP  [TP]  (value not drawn)  (no BOM)
TP5  TP  [TP]  (value not drawn)  (no BOM)
TP6  TP  [TP]  (value not drawn)  (no BOM)
TP7  TP  [TP]  (value not drawn)  (no BOM)
TP8  TP  [TP]  (value not drawn)  (no BOM)
U4  TUSB7340RKMR  [100-WQFN]
U5  24LC01B-I/MS  [SOP65P490X110-8N]
Y1  48MHz  [XTAL_ABM8G-48.000MHZ-18-D2Y-T]

### Ports
+1V1_PWRGD, USB1 (harness USB_1), USB2 (harness USB_2), USB3 (harness USB_3), USB4 (harness USB_4)

### Harnesses
USB_1: USB_D_P, USB_D_N, USB_SS_TX_P, USB_SS_TX_N, USB_SS_RX_P, USB_SS_RX_N, OVERCURRENT, PWRON
USB_2: USB_D_P, USB_D_N, USB_SS_TX_P, USB_SS_TX_N, USB_SS_RX_P, USB_SS_RX_N, OVERCURRENT, PWRON
USB_3: USB_D_P, USB_D_N, USB_SS_TX_P, USB_SS_TX_N, USB_SS_RX_P, USB_SS_RX_N, OVERCURRENT, PWRON
USB_4: USB_D_P, USB_D_N, USB_SS_TX_P, USB_SS_TX_N, USB_SS_RX_P, USB_SS_RX_N, OVERCURRENT, PWRON

### Nets
+1V1: C23.2 C24.2 C25.2 C26.2 C27.2 C28.2 C29.2 C30.2 C31.2 C32.2 C33.2 C34.2 C35.2 C36.2 C37.2 C38.2 C39.2 C40.2 C41.2 U4.A1(VDD11) U4.A4(VDD11) U4.A6(VDD11) U4.A9(VDD11) U4.A12(VDD11) U4.A16(VDD11) U4.A28(VDD11) U4.A31(VDD11) U4.A33(VDD11) U4.A38(VDD11) U4.A50(VDD11) U4.B1(VDD11) U4.B17(VDD11) U4.B19(VDD11) U4.B24(VDD11) U4.B37(VDD11) U4.B40(VDD11) U4.B42(VDD11) U4.B44(VDD11)
+3V3: C42.2 C43.2 C44.2 C45.2 C46.2 C47.2 C48.2 C49.2 C50.2 C60.1 FB1.1 J1.A9(3V3) J1.A10(3V3) J1.B8(3V3) R9.2 R14.1 R15.1 U4.A19(VDDA_3P3) U4.A21(VDDA_3P3) U4.A25(VDDA_3P3) U4.A44(VDDA_3P3) U4.B4(VDDA_3P3) U4.B11(VDDA_3P3) U4.B22(VDDA_3P3) U4.B26(VDDA_3P3) U5.8(VCC)
+12V: J1.A2(12V) J1.A3(12V) J1.B1(12V) J1.B2(12V) J1.B3(12V)
GND: C23.1 C24.1 C25.1 C26.1 C27.1 C28.1 C29.1 C30.1 C31.1 C32.1 C33.1 C34.1 C35.1 C36.1 C37.1 C38.1 C39.1 C40.1 C41.1 C42.1 C43.1 C44.1 C45.1 C46.1 C47.1 C48.1 C49.1 C50.1 C51.1 C52.1 C53.1 C54.1 C55.1 C58.1 C59.1 C60.2 J1.A4(GND) J1.A12(GND) J1.A15(GND) J1.A18(GND) J1.B4(GND) J1.B7(GND) J1.B13(GND) J1.B16(GND) J1.B18(GND) J2.9 R10.2 R12.2 R16.2 R17.2 U4.A53(VSS) U4.B20(VSS) U4.B21(VSS_OSC) U5.1(A0) U5.2(A1) U5.3(A3) U5.4(VSS) U5.7(WP) Y1.2(GND) Y1.4(GND)
EEPROM_SCL: R14.2 R16.1 U4.B2(SCL) U5.6(SCL)
EEPROM_SDA: R15.2 R17.1 U4.A2(SDA) U5.5(SDA)
EN1: U4.B33(*PWRON1) ; port USB1.PWRON
EN2: U4.B34(*PWRON2) ; port USB2.PWRON
EN3: U4.A46(*PWRON3) ; port USB3.PWRON
FLT1: U4.A36(*OVERCUR1) ; port USB1.OVERCURRENT
FLT2: U4.A37(*OVERCUR2) ; port USB2.OVERCURRENT
FLT3: U4.B43(*OVERCUR3) ; port USB3.OVERCURRENT
JTAG_RST: J2.10 U4.B32(*JTAG_RST)
JTAG_TCK: J2.7 U4.A32(JTAG_TCK)
JTAG_TDI: J2.3 U4.A35(JTAG_TDI)
JTAG_TDO: J2.1 U4.B31(JTAG_TDO)
JTAG_TMS: J2.5 U4.B30(JTAG_TMS)
PCIE_3V3AUX: J1.B10(3V3AUX)
PCIE_CLK_N: J1.A14(REFCLKn) U4.B41(PCIE_REFCLKN)
PCIE_CLK_P: J1.A13(REFCLKp) U4.A45(PCIE_REFCLKP)
PCIe_PRSNT: J1.A1(nPRSNT1) J1.B17(nPRSNT2)
PCIE_PWRGD: J1.A11(PWRGD) U4.A40(*PERST)
PCIE_RX_N: J1.B15(PETn0) U4.A42(PCIE_RXN)
PCIE_RX_P: J1.B14(PETp0) U4.B39(PCIE_RXP)
PCIE_TX_N: C57.2 U4.A41(PCIE_TXN)
PCIE_TX_P: C56.2 U4.B38(PCIE_TXP)
PCIE_VDD: C51.2 C52.2 C53.2 C54.2 C55.2 FB1.2 U4.A3(VDD33) U4.A34(VDD33) U4.A39(VDD33) U4.A47(VDD33) U4.A51(VDD33)
PCIE_WAKE: J1.B11(nWAKE) U4.B35(*WAKE)
PCT_N: C57.1 J1.A17(PERn0)
PCT_P: C56.1 J1.A16(PERp0)
NetC58_2: C58.2 R13.1 U4.A23(XI) Y1.1
NetC59_2: C59.2 R13.2 U4.A22(XO) Y1.3
NetC65_2: U4.B5(USB_DP_DN4) ; port USB4.USB_D_P
NetC66_2: U4.A5(USB_DM_DN4) ; port USB4.USB_D_N
NetC87_2: U4.B15(USB_SSTXN_DN1) ; port USB1.USB_SS_TX_N
NetC89_2: U4.A17(USB_SSTXP_DN1) ; port USB1.USB_SS_TX_P
NetC96_2: U4.B10(USB_SSTXN_DN2) ; port USB2.USB_SS_TX_N
NetC97_2: U4.A11(USB_SSTXP_DN2) ; port USB2.USB_SS_TX_P
NetC103_2: U4.A30(USB_SSTXN_DN3) ; port USB3.USB_SS_TX_N
NetC104_2: U4.B28(USB_SSTXP_DN3) ; port USB3.USB_SS_TX_P
NetD6_1: U4.A18(USB_SSRXP_DN1) ; port USB1.USB_SS_RX_P
NetD6_2: U4.B16(USB_SSRXN_DN1) ; port USB1.USB_SS_RX_N
NetD7_1: U4.B9(USB_SSRXP_DN2) ; port USB2.USB_SS_RX_P
NetD7_2: U4.A10(USB_SSRXN_DN2) ; port USB2.USB_SS_RX_N
NetD8_1: U4.B27(USB_SSRXP_DN3) ; port USB3.USB_SS_RX_P
NetD8_2: U4.A29(USB_SSRXN_DN3) ; port USB3.USB_SS_RX_N
NetJ1_A6: J1.A6(TDI) J1.A7(TDO)
NetL1_2: U4.B18(USB_DM_DN1) ; port USB1.USB_D_N
NetL1_3: U4.A20(USB_DP_DN1) ; port USB1.USB_D_P
NetL3_2: U4.A13(USB_DM_DN2) ; port USB2.USB_D_N
NetL3_3: U4.B12(USB_DP_DN2) ; port USB2.USB_D_P
NetL5_2: U4.A27(USB_DM_DN3) ; port USB3.USB_D_N
NetL5_3: U4.B25(USB_DP_DN3) ; port USB3.USB_D_P
NetR5_1: U4.A15(*GRST) ; port +1V1_PWRGD
NetR9_1: R9.1 R10.1 U4.A52(AUX_DET)
NetR11_1: R11.1 U4.B23(R1EXTRTN)
NetR11_2: R11.2 U4.A24(R1EXT)
NetR12_1: R12.1 U4.B14(FREQSEL)
NetR64_1: U4.B45(*OVERCUR4) ; port USB4.OVERCURRENT
NetR65_2: U4.A48(*PWRON4) ; port USB4.PWRON
NetTP3_1: TP3.1 U4.A49(GPIO[0])
NetTP4_1: TP4.1 U4.B46(GPIO[1])
NetTP5_1: TP5.1 U4.B47(GPIO[2])
NetTP6_1: TP6.1 U4.B48(GPIO[3])
NetTP7_1: TP7.1 U4.B36(*CLKREQ)
NetTP8_1: TP8.1 U4.B3(SMI)
NetU4_A7: U4.A7(USB_SSRXN_DN4) ; port USB4.USB_SS_RX_N
NetU4_A8: U4.A8(USB_SSTXN_DN4) ; port USB4.USB_SS_TX_N
NetU4_B6: U4.B6(USB_SSRXP_DN4) ; port USB4.USB_SS_RX_P
NetU4_B7: U4.B7(USB_SSTXP_DN4) ; port USB4.USB_SS_TX_P

Not connected (* = marked no-connect by the designer): J1 A5(TCK)* A8(TMS)* B5(SMCLK)* B6(SMDAT)* B9(nTRST)* B12(nCLKREQ)*; J2 2* 4* 6* 8*; U4 A14(NC)* A26(NC)* A43(NC)* B8(NC)* B13(NC)* B29(NC)* C1(VSS_NC)* C2(VSS_NC)* C3(VSS_NC)* C4(VSS_NC)*

### Layout directives
differential pair: PCIE_CLK_N, PCIE_CLK_P, PCIE_RX_N, PCIE_RX_P, PCIE_TX_N, PCIE_TX_P, PCT_N, PCT_P

### Notes on the sheet
- (near C23) A50
- (near C24) B44
- (near C25) B42
- (near C26) B37
- (near C27) B38
- (near C28) A31
- (near C29) A33
- (near C30) A28
- (near C31) B24
- (near C32) B19
- (near C33) B17
- (near C34) A16
- (near C35) A12
- (near C36) A9
- (near C37) A6
- (near C38) A4
- (near C39) B1
- (near C40) A1
- (near C41) 1V1
- (near C42) A44
- (near C43) B26
- (near C44) B22
- (near C45) A25
- (near C46) A21
- (near C47) A19
- (near C48) B11
- (near C49) B4
- (near C50) 3V3
- (near C51) A25
- (near C52) A21
- (near C53) A19
- (near C54) B11
- (near C55) B4
- Populate for disabled eeprom - 0ohm
- Title:
- Author:
- Size:
- Date:
- A3
- Prj:
- https://www.silardgal.com
- SW Version:
- Variant:
- Edited:
- File:

### Library data of the parts
C23-C40 C42-C49 C51-C55 C60 = 100nF 50V: as C88 on sheet Connectors
C41 C50 = 22uF 6V3: as C76 on sheet Peripherals
C56 C57 = 100nF 50V_1: as C87 on sheet Connectors
C58 C59 = 18pF 50V: CAP CER 18PF 50V C0G/NP0 0603; MPN: GRM1885C1H180JA01D
FB1 = 33R 100MHz: 33 Ohms @ 100 MHz 1 Power Line Ferrite Bead 0603 (1608 Metric) 3A 25mOhm; MPN: BLM18PG330SN1D
J1 = CON_Edge_PCB_PCIe_x1_36P: Connector, PCB Edge, plug 2x18 positions, 1.0mm pitch; ComponentLink1URL: http://nyusperforce.smsc.com//depot_np_hweng_boards/altium_libraries/datasheets/TE_Connectivity (Amp_Tyco)/ENG_CD_5179031_A4.pdfHirose/DF12_catalog.pdf
R9 R10 R12 R14-R17 = 10K 1%: as R51 on sheet Connectors
R11 = 9.09K 1%: 9.09 kOhms ±1% 0.1W, 1/10W Chip Resistor 0603 (1608 Metric) Automotive AEC-Q200 Thick Film; MPN: ERJ-3EKF9091V
R13 = 1M 1%: as R53 on sheet Connectors
U4 = TUSB7340RKMR: USB Host Controller USB 3.0 USB, PCIe Interface 100-WQFN-MR (9x9)
U5 = 24LC01B-I/MS: EEPROM Memory IC 1Kbit I2C 400 kHz 3.5 µs 8-MSOP; MPN: 24LC01B-I/MS
Y1 = ABM8G-48.000MHZ-18-D2Y-T: 48 MHz ±20ppm Crystal 18pF 50 Ohms 4-SMD, No Lead; MPN: ABM8G-48.000MHZ-18-D2Y-T
J2 = TC2050-IDC: MPN: TC2050-IDC

## Sheet MCU.SchDoc: MCU
size A3; Author: Silard Gal; SheetNumber: 5; SheetTotal: 7
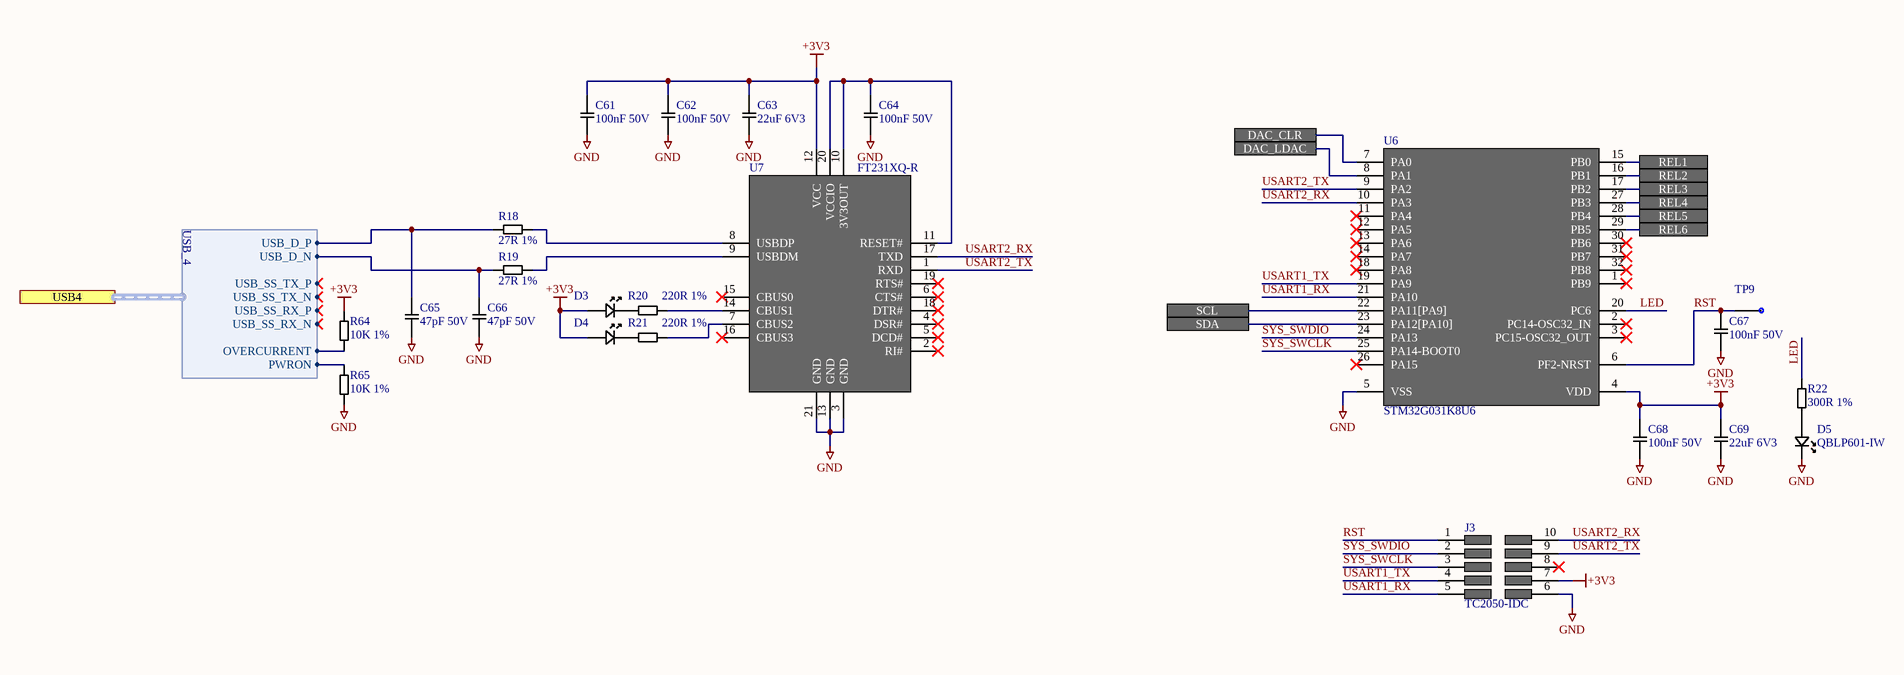
[diagram p5: MCU.SchDoc]

### Parts
C61  100nF 50V  [CAPC1608X06N]
C62  100nF 50V  [CAPC1608X06N]
C63  22uF 6V3  [CAPC1608X06N]
C64  100nF 50V  [CAPC1608X06N]
C65  47pF 50V  [CAPC1608X06N]
C66  47pF 50V  [CAPC1608X06N]
C67  100nF 50V  [CAPC1608X06N]
C68  100nF 50V  [CAPC1608X06N]
C69  22uF 6V3  [CAPC1608X06N]
D3  QBLP601-IW  [LEDC1608X06N]  (value not drawn)
D4  QBLP601-IW  [LEDC1608X06N]  (value not drawn)
D5  QBLP601-IW  [LEDC1608X06N]
J3  TC2050-IDC  [TAG_CONNECT]
R18  27R 1%  [RESC1608X06N]
R19  27R 1%  [RESC1608X06N]
R20  220R 1%  [RESC1608X06N]
R21  220R 1%  [RESC1608X06N]
R22  300R 1%  [RESC1608X06N]
R64  10K 1%  [RESC1608X06N]
R65  10K 1%  [RESC1608X06N]
TP9  TP  [TP]  (value not drawn)  (no BOM)
U6  STM32G031K8U6  [UQFP32P50X50]
U7  FT231XQ-R  [QFN50P400X400X80-21N]

### Ports
DAC_CLR, DAC_LDAC, REL1, REL2, REL3, REL4, REL5, REL6, SCL, SDA, USB4 (harness USB_4)

### Harnesses
USB_4: USB_D_P, USB_D_N, USB_SS_TX_P, USB_SS_TX_N, USB_SS_RX_P, USB_SS_RX_N, OVERCURRENT, PWRON

### Nets
+3V3: C61.1 C62.1 C63.1 C68.1 C69.1 D3.1 D4.1 J3.7 R64.2 U6.4(VDD) U7.12(VCC)
GND: C61.2 C62.2 C63.2 C64.2 C65.1 C66.1 C67.2 C68.2 C69.2 D5.2 J3.6 R65.1 U6.5(VSS) U7.3(GND) U7.13(GND) U7.21(GND)
LED: R22.2 U6.20(PC6)
RST: C67.1 J3.1 TP9.1 U6.6(PF2-NRST)
SYS_SWCLK: J3.3 U6.25(PA14-BOOT0)
SYS_SWDIO: J3.2 U6.24(PA13)
USART1_RX: J3.5 U6.21(PA10)
USART1_TX: J3.4 U6.19(PA9)
USART2_RX: J3.10 U6.10(PA3) U7.17(TXD)
USART2_TX: J3.9 U6.9(PA2) U7.1(RXD)
NetC64_1: C64.1 U7.10(3V3OUT) U7.11(RESET#) U7.20(VCCIO)
NetC65_2: C65.2 R18.1 ; port USB4.USB_D_P
NetC66_2: C66.2 R19.1 ; port USB4.USB_D_N
NetD3_2: D3.2 R20.1
NetD4_2: D4.2 R21.1
NetD5_1: D5.1 R22.1
NetR18_2: R18.2 U7.8(USBDP)
NetR19_2: R19.2 U7.9(USBDM)
NetR20_2: R20.2 U7.14(CBUS1)
NetR21_2: R21.2 U7.7(CBUS2)
NetR31_2: U6.8(PA1) ; port DAC_LDAC
NetR32_2: U6.7(PA0) ; port DAC_CLR
NetR33_2: U6.23(PA12[PA10]) ; port SDA
NetR34_2: U6.22(PA11[PA9]) ; port SCL
NetR35_1: U6.15(PB0) ; port REL1
NetR36_1: U6.16(PB1) ; port REL2
NetR37_1: U6.17(PB2) ; port REL3
NetR38_1: U6.27(PB3) ; port REL4
NetR47_1: U6.28(PB4) ; port REL5
NetR48_1: U6.29(PB5) ; port REL6
NetR64_1: R64.1 ; port USB4.OVERCURRENT
NetR65_2: R65.2 ; port USB4.PWRON

Not connected (* = marked no-connect by the designer): J3 8*; U6 1(PB9)* 2(PC14-OSC32_IN)* 3(PC15-OSC32_OUT)* 11(PA4)* 12(PA5)* 13(PA6)* 14(PA7)* 18(PA8)* 26(PA15)* 30(PB6)* 31(PB7)* 32(PB8)*; U7 2(RI#)* 4(DSR#)* 5(DCD#)* 6(CTS#)* 15(CBUS0)* 16(CBUS3)* 18(DTR#)* 19(RTS#)*

### Notes on the sheet
- Title:
- Author:
- Size:
- Date:
- A3
- Prj:
- https://www.silardgal.com
- SW Version:
- Variant:
- Edited:
- File:

### Library data of the parts
C61 C62 C64 C67 C68 = 100nF 50V: as C88 on sheet Connectors
C63 C69 = 22uF 6V3: as C76 on sheet Peripherals
C65 C66 = 47pF 50V: 47 pF ±5% 50V Ceramic Capacitor C0G, NP0 0603 (1608 Metric); MPN: CL10C470JB8NNNC
D3-D5 = LED WHITE: White LED Indication - Discrete 3.2V 0603 (1608 Metric); MPN: QBLP601-IW
R18 R19 = 27R 1%: 27 Ohms ±1% 0.1W, 1/10W Chip Resistor 0603 (1608 Metric) Moisture Resistant Thick Film; MPN: RC0603FR-0727RL
R20 R21 = 220R 1%: 220 Ohms ±1% 0.1W, 1/10W Chip Resistor 0603 (1608 Metric) Automotive AEC-Q200 Thick Film; MPN: ERJ-3EKF2200V
R22 = 300R 1%: 300 Ohms ±1% 0.1W, 1/10W Chip Resistor 0603 (1608 Metric) Automotive AEC-Q200 Thick Film; MPN: ERJ-3EKF3000V
R64 R65 = 10K 1%: as R51 on sheet Connectors
U6 = STM32G031K8U6: ARM® Cortex®-M0+ STM32G0 Microcontroller IC 32-Bit Single-Core 64MHz 64KB (64K x 8) FLASH 32-UFQFPN (5x5); MPN: STM32G031K8U6
U7 = FT231XQ-R: USB Bridge, USB to UART USB 2.0 UART Interface 20-QFN (4x4); MPN: FT231XQ-R
J3 = TC2050-IDC: MPN: TC2050-IDC

## Sheet Power.SchDoc: Power
size A3; Author: Silard Gal; SheetNumber: 3; SheetTotal: 7
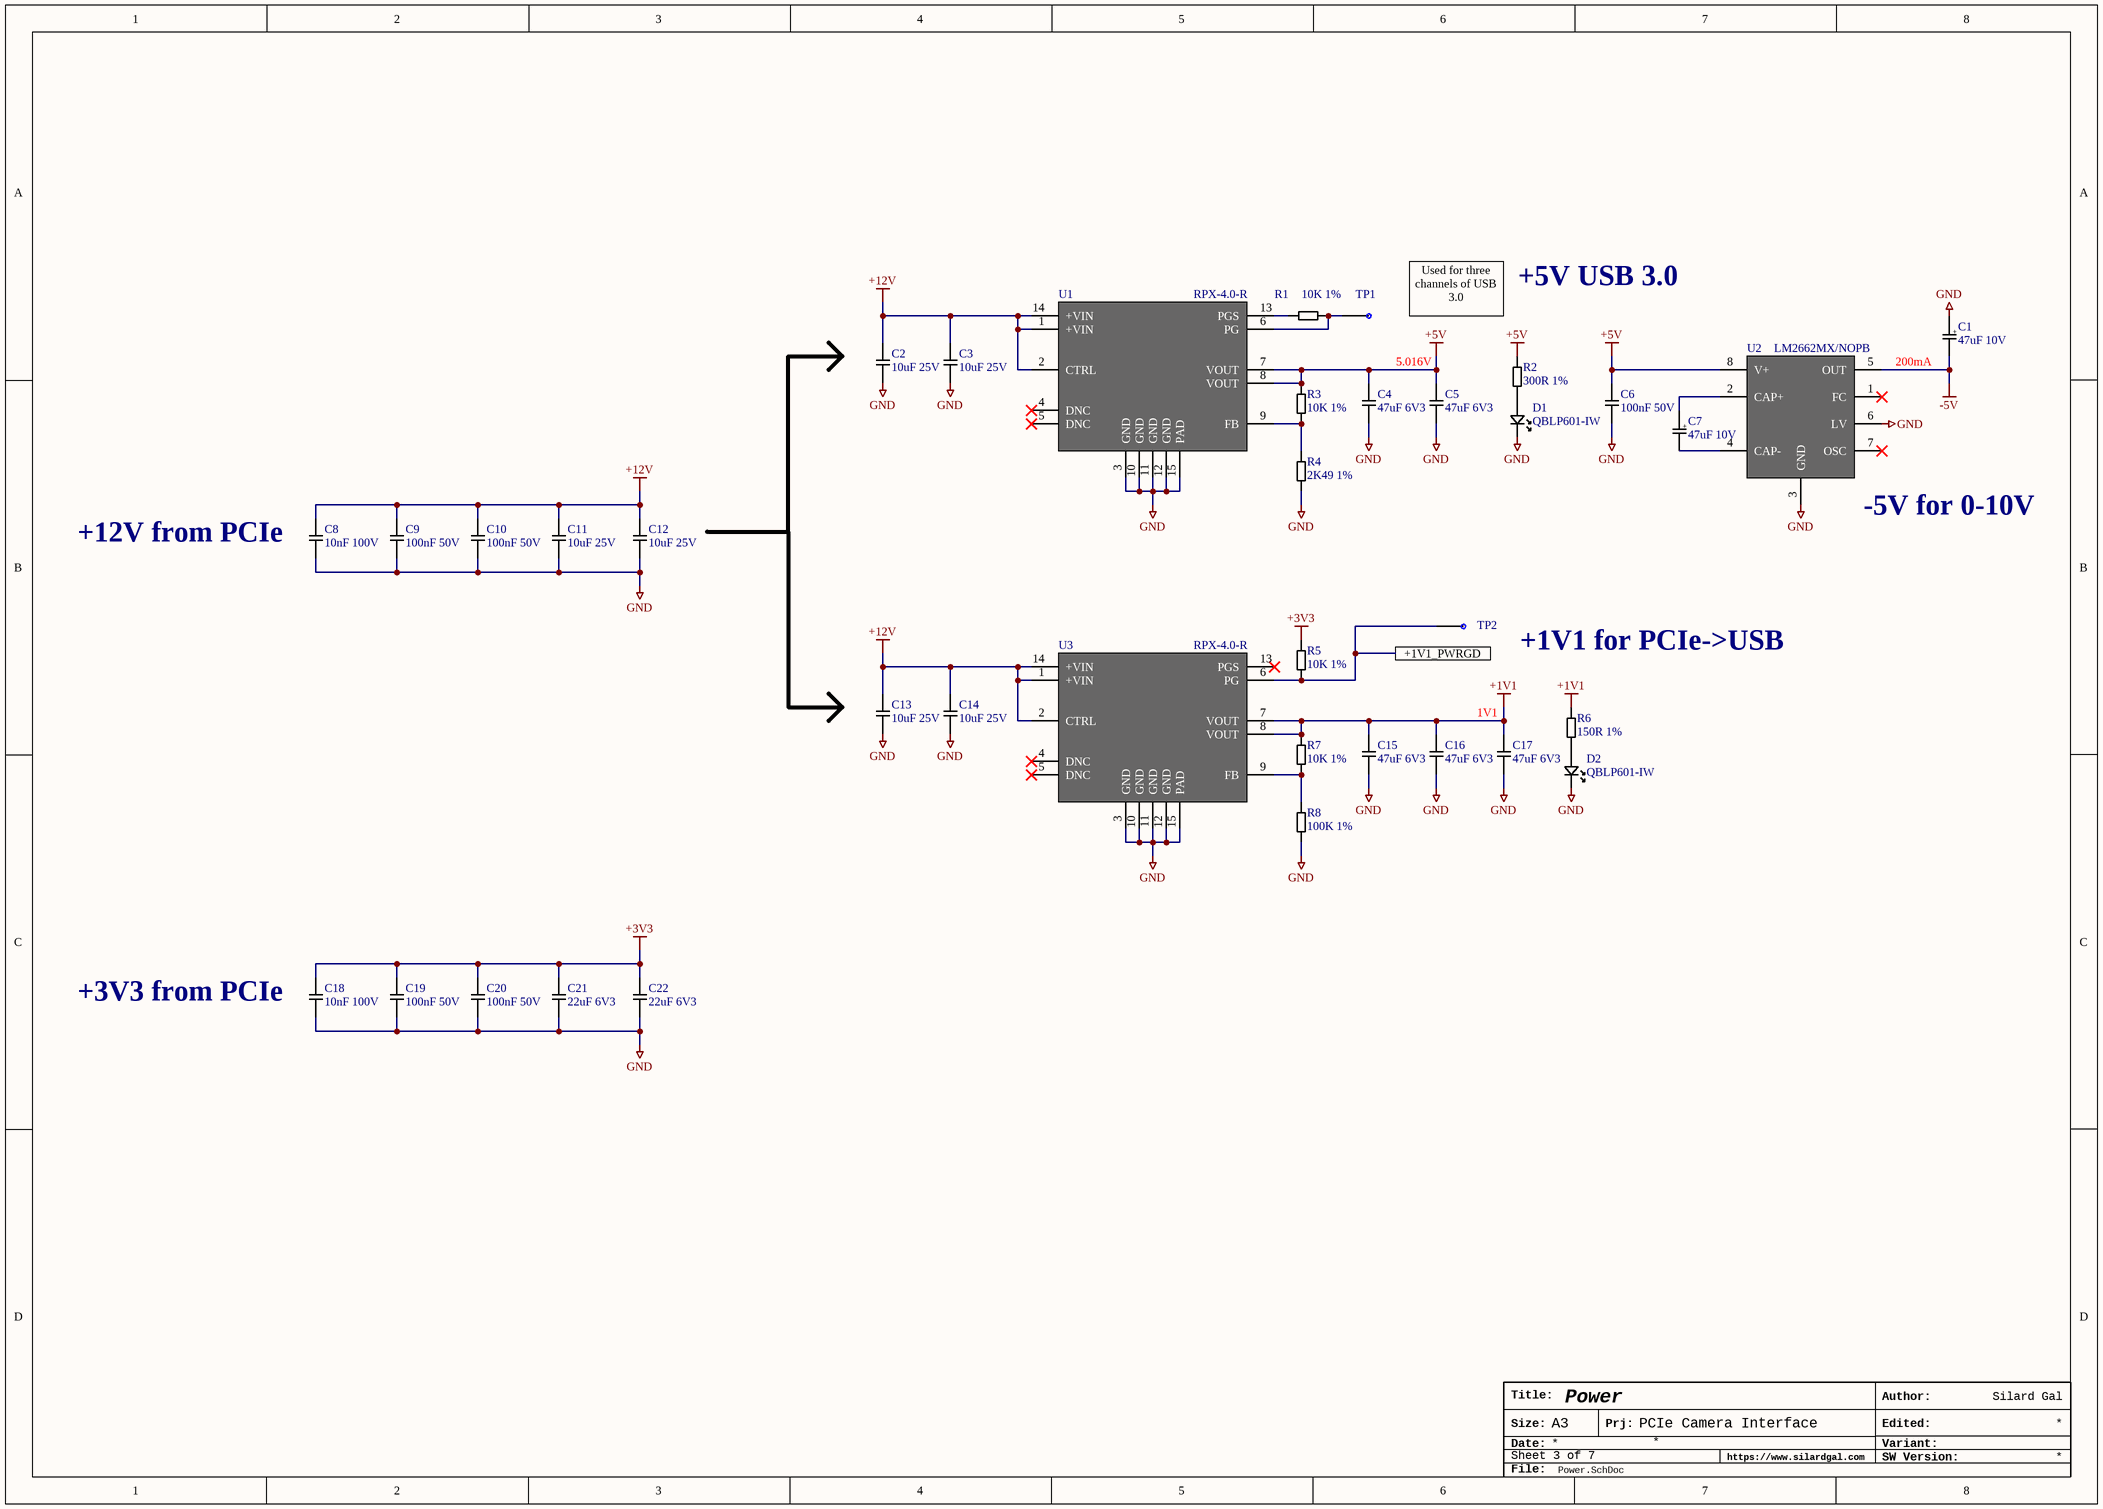
[diagram p6: Power.SchDoc]

### Parts
C1  47uF 10V  [293D476X9010B2TE3]
C2  10uF 25V  [CAPC1608X06N]
C3  10uF 25V  [CAPC1608X06N]
C4  47uF 6V3  [CAPC1608X06N]
C5  47uF 6V3  [CAPC1608X06N]
C6  100nF 50V  [CAPC1608X06N]
C7  47uF 10V  [293D476X9010B2TE3]
C8  10nF 100V  [CAPC1608X06N]
C9  100nF 50V  [CAPC1608X06N]
C10  100nF 50V  [CAPC1608X06N]
C11  10uF 25V  [CAPC1608X06N]
C12  10uF 25V  [CAPC1608X06N]
C13  10uF 25V  [CAPC1608X06N]
C14  10uF 25V  [CAPC1608X06N]
C15  47uF 6V3  [CAPC1608X06N]
C16  47uF 6V3  [CAPC1608X06N]
C17  47uF 6V3  [CAPC1608X06N]
C18  10nF 100V  [CAPC1608X06N]
C19  100nF 50V  [CAPC1608X06N]
C20  100nF 50V  [CAPC1608X06N]
C21  22uF 6V3  [CAPC1608X06N]
C22  22uF 6V3  [CAPC1608X06N]
D1  QBLP601-IW  [LEDC1608X06N]
D2  QBLP601-IW  [LEDC1608X06N]
R1  10K 1%  [RESC1608X06N]
R2  300R 1%  [RESC1608X06N]
R3  10K 1%  [RESC1608X06N]
R4  2K49 1%  [RESC1608X06N]
R5  10K 1%  [RESC1608X06N]
R6  150R 1%  [RESC1608X06N]
R7  10K 1%  [RESC1608X06N]
R8  100K 1%  [RESC1608X06N]
TP1  TP  [TP]  (value not drawn)  (no BOM)
TP2  TP  [TP]  (value not drawn)  (no BOM)
U1  RPX-4.0-R  [REPC-4.0]
U2  LM2662MX/NOPB  [SOIC127P599X175-8N]
U3  RPX-4.0-R  [REPC-4.0]

### Ports
+1V1_PWRGD

### Nets
+1V1: C15.2 C16.2 C17.2 R6.2 R7.2 U3.7(VOUT) U3.8(VOUT)
+3V3: C18.2 C19.2 C20.2 C21.2 C22.2 R5.2
+5V: C4.2 C5.2 C6.2 R2.2 R3.2 U1.7(VOUT) U1.8(VOUT) U2.8(V+)
+12V: C2.2 C3.2 C8.2 C9.2 C10.2 C11.2 C12.2 C13.2 C14.2 U1.1(+VIN) U1.2(CTRL) U1.14(+VIN) U3.1(+VIN) U3.2(CTRL) U3.14(+VIN)
-5V: C1.2 U2.5(OUT)
GND: C1.1 C2.1 C3.1 C4.1 C5.1 C6.1 C8.1 C9.1 C10.1 C11.1 C12.1 C13.1 C14.1 C15.1 C16.1 C17.1 C18.1 C19.1 C20.1 C21.1 C22.1 D1.2 D2.2 R4.1 R8.1 U1.3(GND) U1.10(GND) U1.11(GND) U1.12(GND) U1.15(PAD) U2.3(GND) U2.6(LV) U3.3(GND) U3.10(GND) U3.11(GND) U3.12(GND) U3.15(PAD)
NetC7_1: C7.1 U2.2(CAP+)
NetC7_2: C7.2 U2.4(CAP-)
NetD1_1: D1.1 R2.1
NetD2_1: D2.1 R6.1
NetR1_1: R1.1 U1.13(PGS)
NetR1_2: R1.2 TP1.1 U1.6(PG)
NetR3_1: R3.1 R4.2 U1.9(FB)
NetR5_1: R5.1 TP2.1 U3.6(PG) ; port +1V1_PWRGD
NetR7_1: R7.1 R8.2 U3.9(FB)

Not connected (* = marked no-connect by the designer): U1 4(DNC)* 5(DNC)*; U2 1(FC)* 7(OSC)*; U3 4(DNC)* 5(DNC)* 13(PGS)*

### Notes on the sheet
- Used for three channels of USB 3.0
- +5V USB 3.0
- 5.016V
- 200mA
- (near U2) -5V for 0-10V
- (near C8) +12V from PCIe
- +1V1 for PCIe->USB
- (near C17) 1V1
- (near C18) +3V3 from PCIe
- Title:
- Author:
- Size:
- Date:
- A3
- Prj:
- https://www.silardgal.com
- SW Version:
- Variant:
- Edited:
- File:
- (in symbol 47uF 10V) +

### Library data of the parts
C1 C7 = 47uF 10V: 47 µF Molded Tantalum Capacitors 10 V 1411 (3528 Metric) 1.8Ohm; MPN: 293D476X9010B2TE3
C2 C3 C11-C14 = 10uF 25V: as C71 on sheet Peripherals
C4 C5 C15-C17 = 47uF 6V3: 10 µF ±20% 25V Ceramic Capacitor X5R 0603 (1608 Metric); MPN: GRM188R60J476ME15D
C6 C9 C10 C19 C20 = 100nF 50V: as C88 on sheet Connectors
C8 C18 = 10nF 100V: as C93 on sheet Connectors
C21 C22 = 22uF 6V3: as C76 on sheet Peripherals
D1 D2 = LED WHITE: as D3 on sheet MCU; MPN: QBLP601-IW
R1 R3 R5 R7 = 10K 1%: as R51 on sheet Connectors
R2 = 300R 1%: as R22 on sheet MCU
R4 = 2K49 1%: as R23 on sheet Peripherals
R6 = 150R 1%: 150 Ohms ±1% 0.1W, 1/10W Chip Resistor 0603 (1608 Metric) Automotive AEC-Q200 Thick Film; MPN: ERJ-3EKF1500V
R8 = 100K 1%: 100 kOhms ±1% 0.1W, 1/10W Chip Resistor 0603 (1608 Metric) Moisture Resistant Thick Film; MPN: RC0603FR-07100KL
U1 U3 = RPX-4.0-R: Non-Isolated PoL Module DC DC Converter 1 Output 1 ~ 7V 4A 3.8V - 36V Input; MPN: RPX-4.0-R
U2 = LM2662MX/NOPB: Switching Voltage Regulators Switched Capacitor Vtg Cnvtr; MPN: LM2662MX/NOPB

## Nets that join several sheets
+1V1: PCIe_USB (38 pins), Power (7 pins)
+3V3: Connectors (R51.2 R52.2 R58.2 R59.2), Peripherals (7 pins), PCIe_USB (26 pins), MCU (11 pins), Power (6 pins)
+5V: Connectors (6 pins), Peripherals (C71.2 U9.2 U9.3), Power (8 pins)
+12V: Connectors (C107.1 J7.11 J7.23), Peripherals (12 pins), PCIe_USB (5 pins), Power (15 pins)
-5V: Peripherals (C84.2 C85.2 U8.11 U12.11), Power (C1.2 U2.5)
GND: Connectors (39 pins), Peripherals (35 pins), PCIe_USB (60 pins), MCU (16 pins), Power (37 pins)
EN1: Connectors (R54.2 U14.4), PCIe_USB (U4.B33)
EN2: Connectors (R55.2 U14.5), PCIe_USB (U4.B34)
EN3: Connectors (R60.2 U15.4), PCIe_USB (U4.A46)
FLT1: Connectors (R51.1 U14.10), PCIe_USB (U4.A36)
FLT2: Connectors (R52.1 U14.6), PCIe_USB (U4.A37)
FLT3: Connectors (R58.1 U15.10), PCIe_USB (U4.B43)
NetC65_2: PCIe_USB (U4.B5), MCU (C65.2 R18.1)
NetC66_2: PCIe_USB (U4.A5), MCU (C66.2 R19.1)
NetC70_2: Connectors (J7.7), Peripherals (C70.2 R24.2 U8.1)
NetC73_2: Connectors (J7.19), Peripherals (C73.2 R26.2 U8.7)
NetC74_2: Connectors (J7.8), Peripherals (C74.2 R28.2 U8.8)
NetC78_2: Connectors (J7.20), Peripherals (C78.2 R30.2 U8.14)
NetC79_2: Connectors (J7.9), Peripherals (C79.2 R40.2 U12.1)
NetC82_2: Connectors (J7.21), Peripherals (C82.2 R42.2 U12.7)
NetC83_2: Connectors (J7.10), Peripherals (C83.2 R44.2 U12.8)
NetC86_2: Connectors (J7.22), Peripherals (C86.2 R50.2 U12.14)
NetC87_2: Connectors (C87.2), PCIe_USB (U4.B15)
NetC89_2: Connectors (C89.2), PCIe_USB (U4.A17)
NetC96_2: Connectors (C96.2), PCIe_USB (U4.B10)
NetC97_2: Connectors (C97.2), PCIe_USB (U4.A11)
NetC103_2: Connectors (C103.2), PCIe_USB (U4.A30)
NetC104_2: Connectors (C104.2), PCIe_USB (U4.B28)
NetD6_1: Connectors (D6.1 J4.6), PCIe_USB (U4.A18)
NetD6_2: Connectors (D6.2 J4.5), PCIe_USB (U4.B16)
NetD7_1: Connectors (D7.1 J5.6), PCIe_USB (U4.B9)
NetD7_2: Connectors (D7.2 J5.5), PCIe_USB (U4.A10)
NetD8_1: Connectors (D8.1 J6.6), PCIe_USB (U4.B27)
NetD8_2: Connectors (D8.2 J6.5), PCIe_USB (U4.A29)
NetJ7_1: Connectors (J7.1), Peripherals (K1.3 K1.6)
NetJ7_2: Connectors (J7.2), Peripherals (K2.3 K2.6)
NetJ7_3: Connectors (J7.3), Peripherals (K3.3 K3.6)
NetJ7_4: Connectors (J7.4), Peripherals (K4.3 K4.6)
NetJ7_5: Connectors (J7.5), Peripherals (K5.3 K5.6)
NetJ7_6: Connectors (J7.6), Peripherals (K6.3 K6.6)
NetJ7_13: Connectors (J7.13), Peripherals (K1.4 K1.5)
NetJ7_14: Connectors (J7.14), Peripherals (K2.4 K2.5)
NetJ7_15: Connectors (J7.15), Peripherals (K3.4 K3.5)
NetJ7_16: Connectors (J7.16), Peripherals (K4.4 K4.5)
NetJ7_17: Connectors (J7.17), Peripherals (K5.4 K5.5)
NetJ7_18: Connectors (J7.18), Peripherals (K6.4 K6.5)
NetL1_2: Connectors (L1.2), PCIe_USB (U4.B18)
NetL1_3: Connectors (L1.3), PCIe_USB (U4.A20)
NetL3_2: Connectors (L3.2), PCIe_USB (U4.A13)
NetL3_3: Connectors (L3.3), PCIe_USB (U4.B12)
NetL5_2: Connectors (L5.2), PCIe_USB (U4.A27)
NetL5_3: Connectors (L5.3), PCIe_USB (U4.B25)
NetR5_1: PCIe_USB (U4.A15), Power (R5.1 TP2.1 U3.6)
NetR31_2: Peripherals (R31.2 TP22.1 U11.8), MCU (U6.8)
NetR32_2: Peripherals (R32.2 TP23.1 U11.16), MCU (U6.7)
NetR33_2: Peripherals (R33.2 U11.5), MCU (U6.23)
NetR34_2: Peripherals (R34.2 U11.6), MCU (U6.22)
NetR35_1: Peripherals (R35.1 TP10.1 U10.1), MCU (U6.15)
NetR36_1: Peripherals (R36.1 TP11.1 U10.2), MCU (U6.16)
NetR37_1: Peripherals (R37.1 TP12.1 U10.3), MCU (U6.17)
NetR38_1: Peripherals (R38.1 TP13.1 U10.4), MCU (U6.27)
NetR47_1: Peripherals (R47.1 TP24.1 U13.1), MCU (U6.28)
NetR48_1: Peripherals (R48.1 TP25.1 U13.2), MCU (U6.29)
NetR64_1: PCIe_USB (U4.B45), MCU (R64.1)
NetR65_2: PCIe_USB (U4.A48), MCU (R65.2)

## Assembly variants
Manufacturing: not fitted R? R? R?